# Altium project W2-M_BOARD.PrjPcb
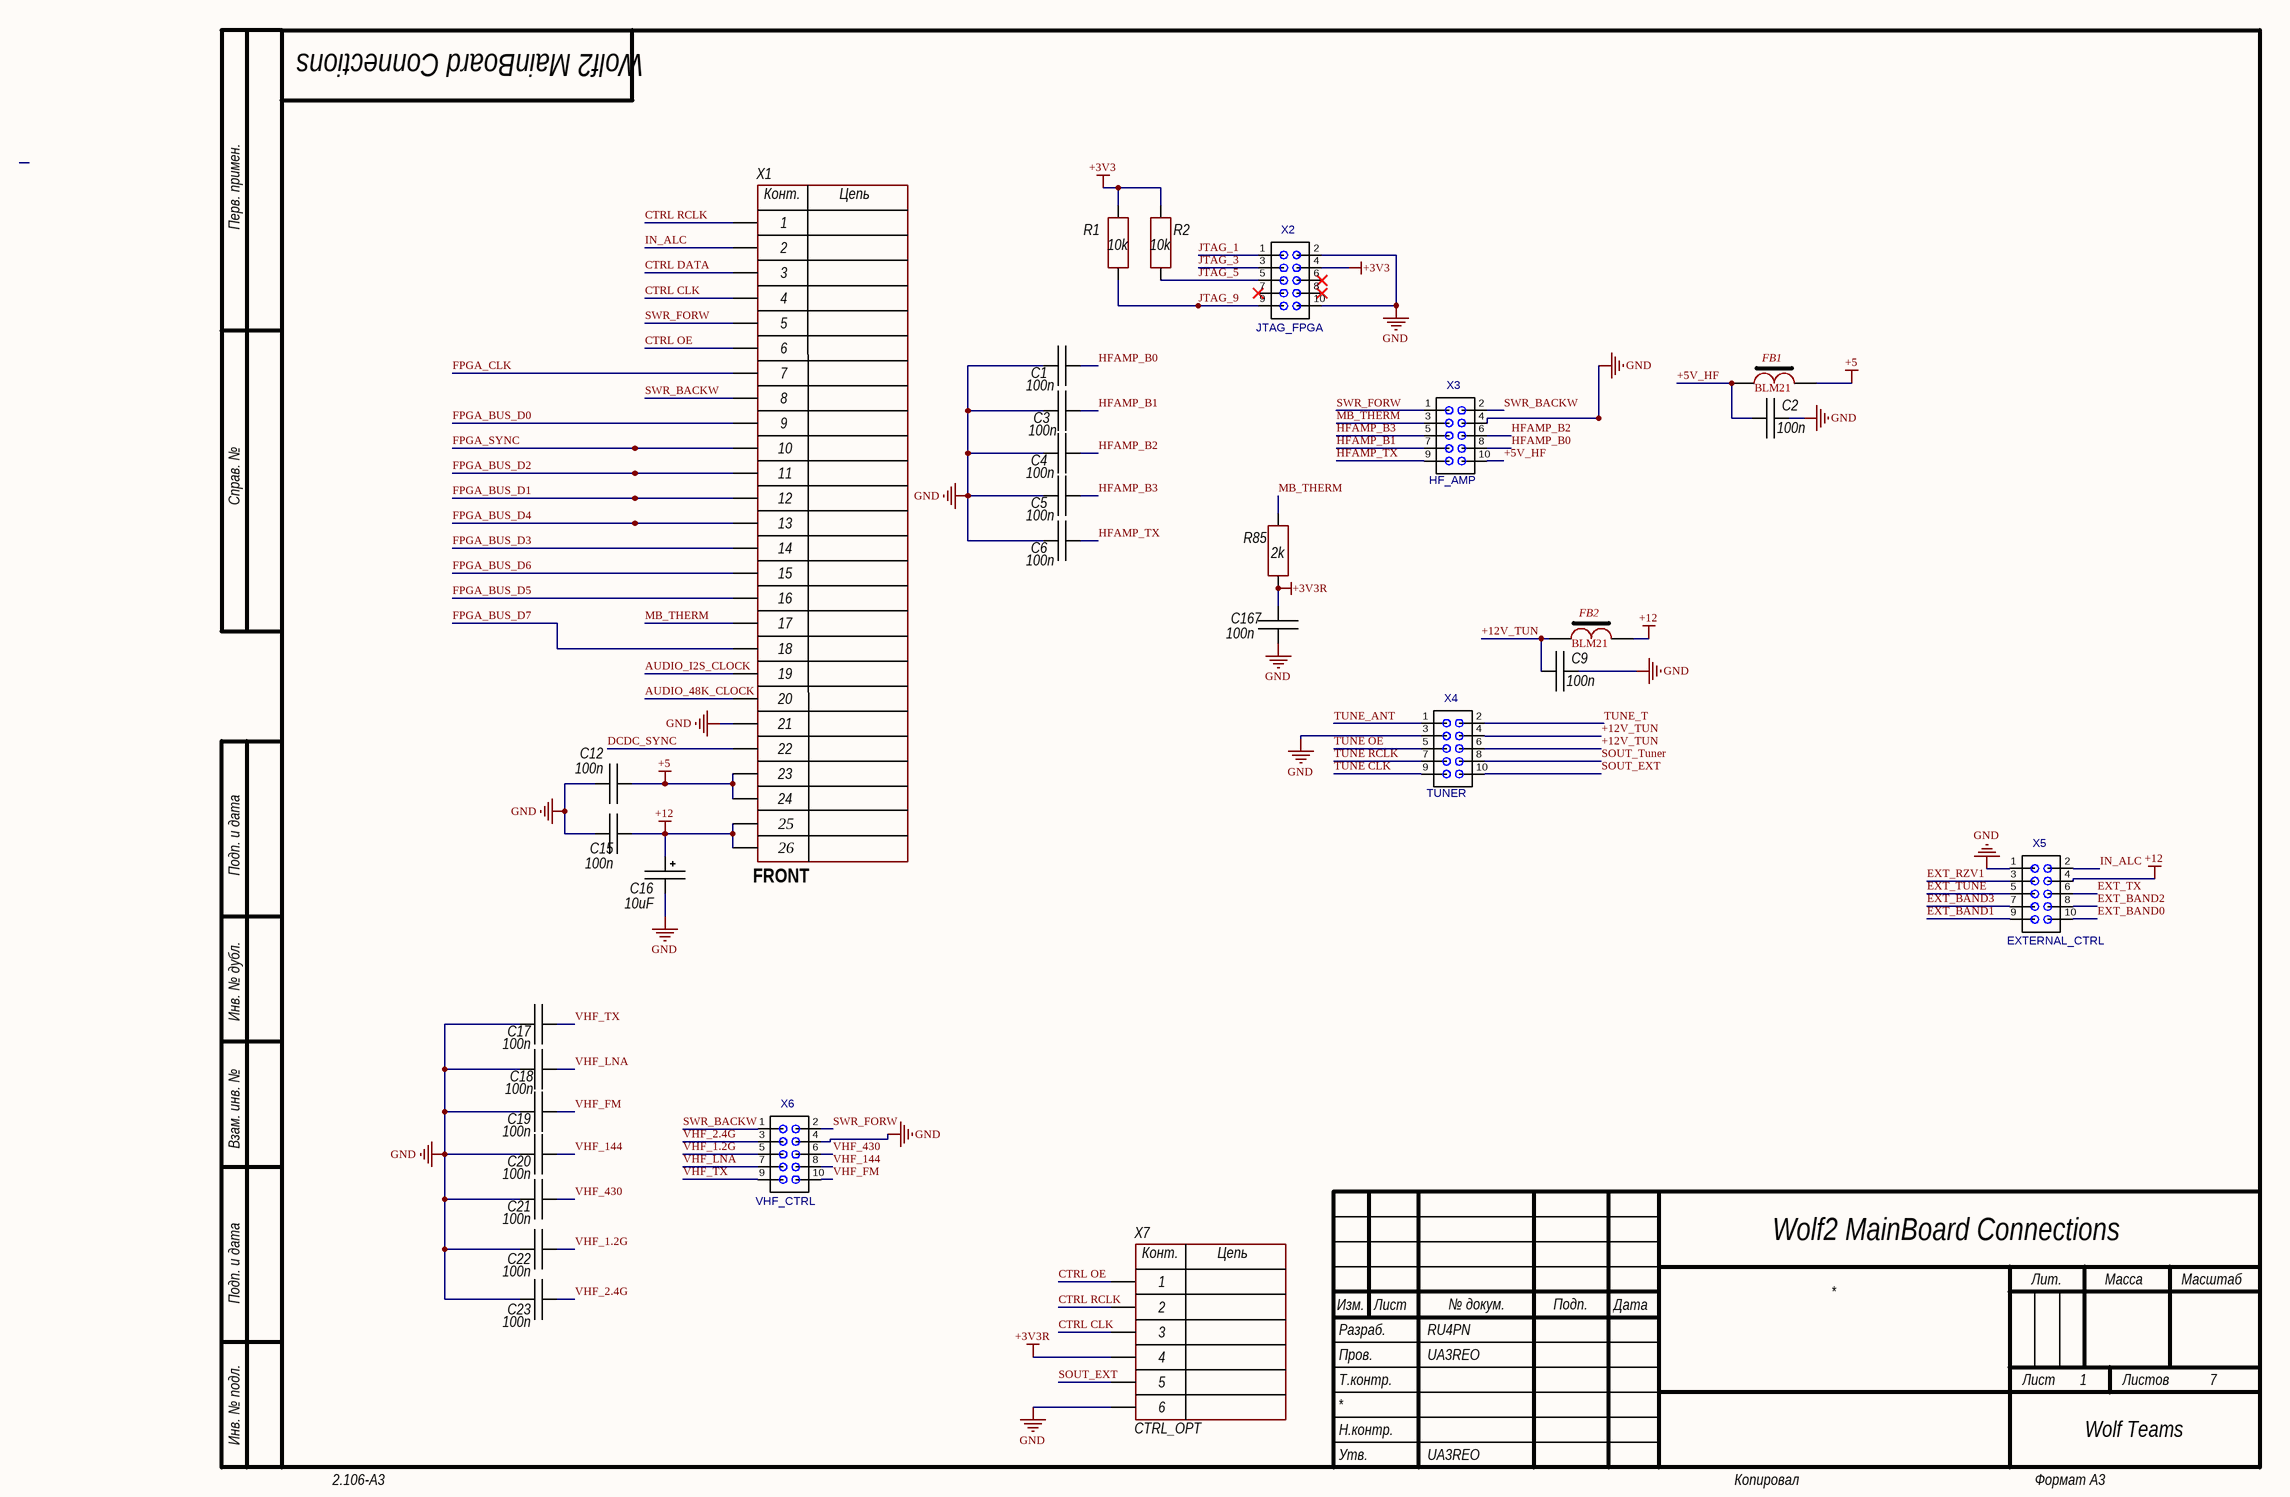
[diagram p0: MB_Conn.SchDoc]
7 sheets, 363 parts. Net scope: global (net labels, ports and power ports of the same name join across sheets).
Board file: MB_PCB.PcbDoc
Sheets:
  MB_Conn.SchDoc
  MB_FPGA.SchDoc
  MB_Power.SchDoc
  MB_ADC.SchDoc
  MB_DAC.SchDoc
  MB_RF.SchDoc
  MB_Control.SchDoc

## Sheet MB_Conn.SchDoc
size 420 x 297 mm; Date: 18/12/2022; ApprovedBy: UA3REO; CheckedBy: UA3REO; Author: RU4PN; CompanyName: Wolf Teams; DocumentNumber: Wolf2 MainBoard Connections; Revision: 0.2; SheetNumber: 1; SheetTotal: 7

### Parts
C1  100n  [CH0805C]
C2  100n  [CH0805C]
C3  100n  [CH0805C]
C4  100n  [CH0805C]
C5  100n  [CH0805C]
C6  100n  [CH0805C]
C9  100n  [CH0805C]
C12  100n  [CH0805C]
C15  100n  [CH0805C]
C16  10uF  [TANTAL_B]
C17  100n  [CH0805C]
C18  100n  [CH0805C]
C19  100n  [CH0805C]
C20  100n  [CH0805C]
C21  100n  [CH0805C]
C22  100n  [CH0805C]
C23  100n  [CH0805C]
C167  100n  [CH0805C]
FB1  BLM21  [CH0805L]
FB2  BLM21  [CH0805L]
R1  10k  [CH0805R]
R2  10k  [CH0805R]
R85  2k  [CH0805R]
X1  FRONT  [CON: IDC-26]
X2  JTAG_FPGA  [CON: BH-10]
X3  HF_AMP  [CON: BH-10]
X4  TUNER  [CON: BH-10]
X5  EXTERNAL_CTRL  [CON: BH-10]
X6  VHF_CTRL  [CON: BH-10]
X7  CTRL_OPT  [CON: PBS-6]

### Nets
+3V3: R1.2 R2.2 X2.4
+3V3R: C167.2 R85.1 X7.4
+5: C12.1 FB1.1 X1.23 X1.24
+12: C15.1 C16.1 FB2.1 X1.25 X1.26 X5.4
GND: C1.2 C2.2 C3.2 C4.2 C5.2 C6.2 C9.2 C12.2 C15.2 C16.2 C17.2 C18.2 C19.2 C20.2 C21.2 C22.2 C23.2 C167.1 X1.21 X2.2 X2.10 X3.4 X4.3 X5.1 X6.4 X7.6
+5V_HF: C2.1 FB1.2 X3.10
+12V_TUN: C9.1 FB2.2 X4.4 X4.6
AUDIO_48K_CLOCK: X1.20
AUDIO_I2S_CLOCK: X1.19
CTRL CLK: X1.4 X7.3
CTRL DATA: X1.3
CTRL OE: X1.6 X7.1
CTRL RCLK: X1.1 X7.2
DCDC_SYNC: X1.22
EXT_BAND0: X5.10
EXT_BAND1: X5.9
EXT_BAND2: X5.8
EXT_BAND3: X5.7
EXT_RZV1: X5.3
EXT_TUNE: X5.5
EXT_TX: X5.6
FPGA_BUS_D0: X1.9
FPGA_BUS_D1: X1.12
FPGA_BUS_D2: X1.11
FPGA_BUS_D3: X1.14
FPGA_BUS_D4: X1.13
FPGA_BUS_D5: X1.16
FPGA_BUS_D6: X1.15
FPGA_BUS_D7: X1.18
FPGA_CLK: X1.7
FPGA_SYNC: X1.10
HFAMP_B0: C1.1 X3.8
HFAMP_B1: C3.1 X3.7
HFAMP_B2: C4.1 X3.6
HFAMP_B3: C5.1 X3.5
HFAMP_TX: C6.1 X3.9
IN_ALC: X1.2 X5.2
JTAG_1: X2.1
JTAG_3: X2.3
JTAG_5: R2.1 X2.5
JTAG_9: R1.1 X2.9
MB_THERM: R85.2 X1.17 X3.3
SOUT_EXT: X4.10 X7.5
SOUT_Tuner: X4.8
SWR_BACKW: X1.8 X3.2 X6.1
SWR_FORW: X1.5 X3.1 X6.2
TUNE CLK: X4.9
TUNE OE: X4.5
TUNE RCLK: X4.7
TUNE_ANT: X4.1
TUNE_T: X4.2
VHF_1.2G: C22.1 X6.5
VHF_2.4G: C23.1 X6.3
VHF_144: C20.1 X6.8
VHF_430: C21.1 X6.6
VHF_FM: C19.1 X6.10
VHF_LNA: C18.1 X6.7
VHF_TX: C17.1 X6.9

Not connected (* = marked no-connect by the designer): X2 6* 7* 8*

### Notes on the sheet
- Перв. примен.
- Справ. №
- Подп. и дата
- Инв. № дубл.
- Взам. инв. №
- Разраб.
- Изм.
- Лист
- № докум.
- Подп.
- Дата
- Лит.
- Масса
- Масштаб
- Пров.
- Т.контр.
- Листов
- Инв. № подл.
- Утв.
- Н.контр.
- 2.106-A3
- Копировал
- Формат А3
- (in symbol 6-Connector) Конт.; Цепь
- (in symbol 26-Connector) Конт.; Цепь

### Library data of the parts
C1-C6 C9 C12 C15 C17-C23 C167 = Capacitor: Manufacturer: *; Model: *; HelpURL: *; ComponentKind: *; Value: *
C16 = TantalCap: Manufacturer: *; Model: *; HelpURL: *; ComponentKind: *; Value: *
FB1 FB2 = FB-1
R1 R2 R85 = Resistor: Manufacturer: *; Model: *; HelpURL: *; ComponentKind: *; Value: *
X1 = 26-Connector: Model: *; Manufacturer: *; HelpURL: *; ComponentKind: *
X2-X6 = IDC10: 2*5 Pin
X7 = 6-Connector: Model: *; Manufacturer: *; HelpURL: *; ComponentKind: *

## Sheet MB_FPGA.SchDoc
size 420 x 297 mm; Date: 18/12/2022; ApprovedBy: UA3REO; CheckedBy: UA3REO; Author: RU4PN; CompanyName: Wolf Teams; DocumentNumber: Wolf2 MainBoard FPGA; SheetNumber: 2; SheetTotal: 7
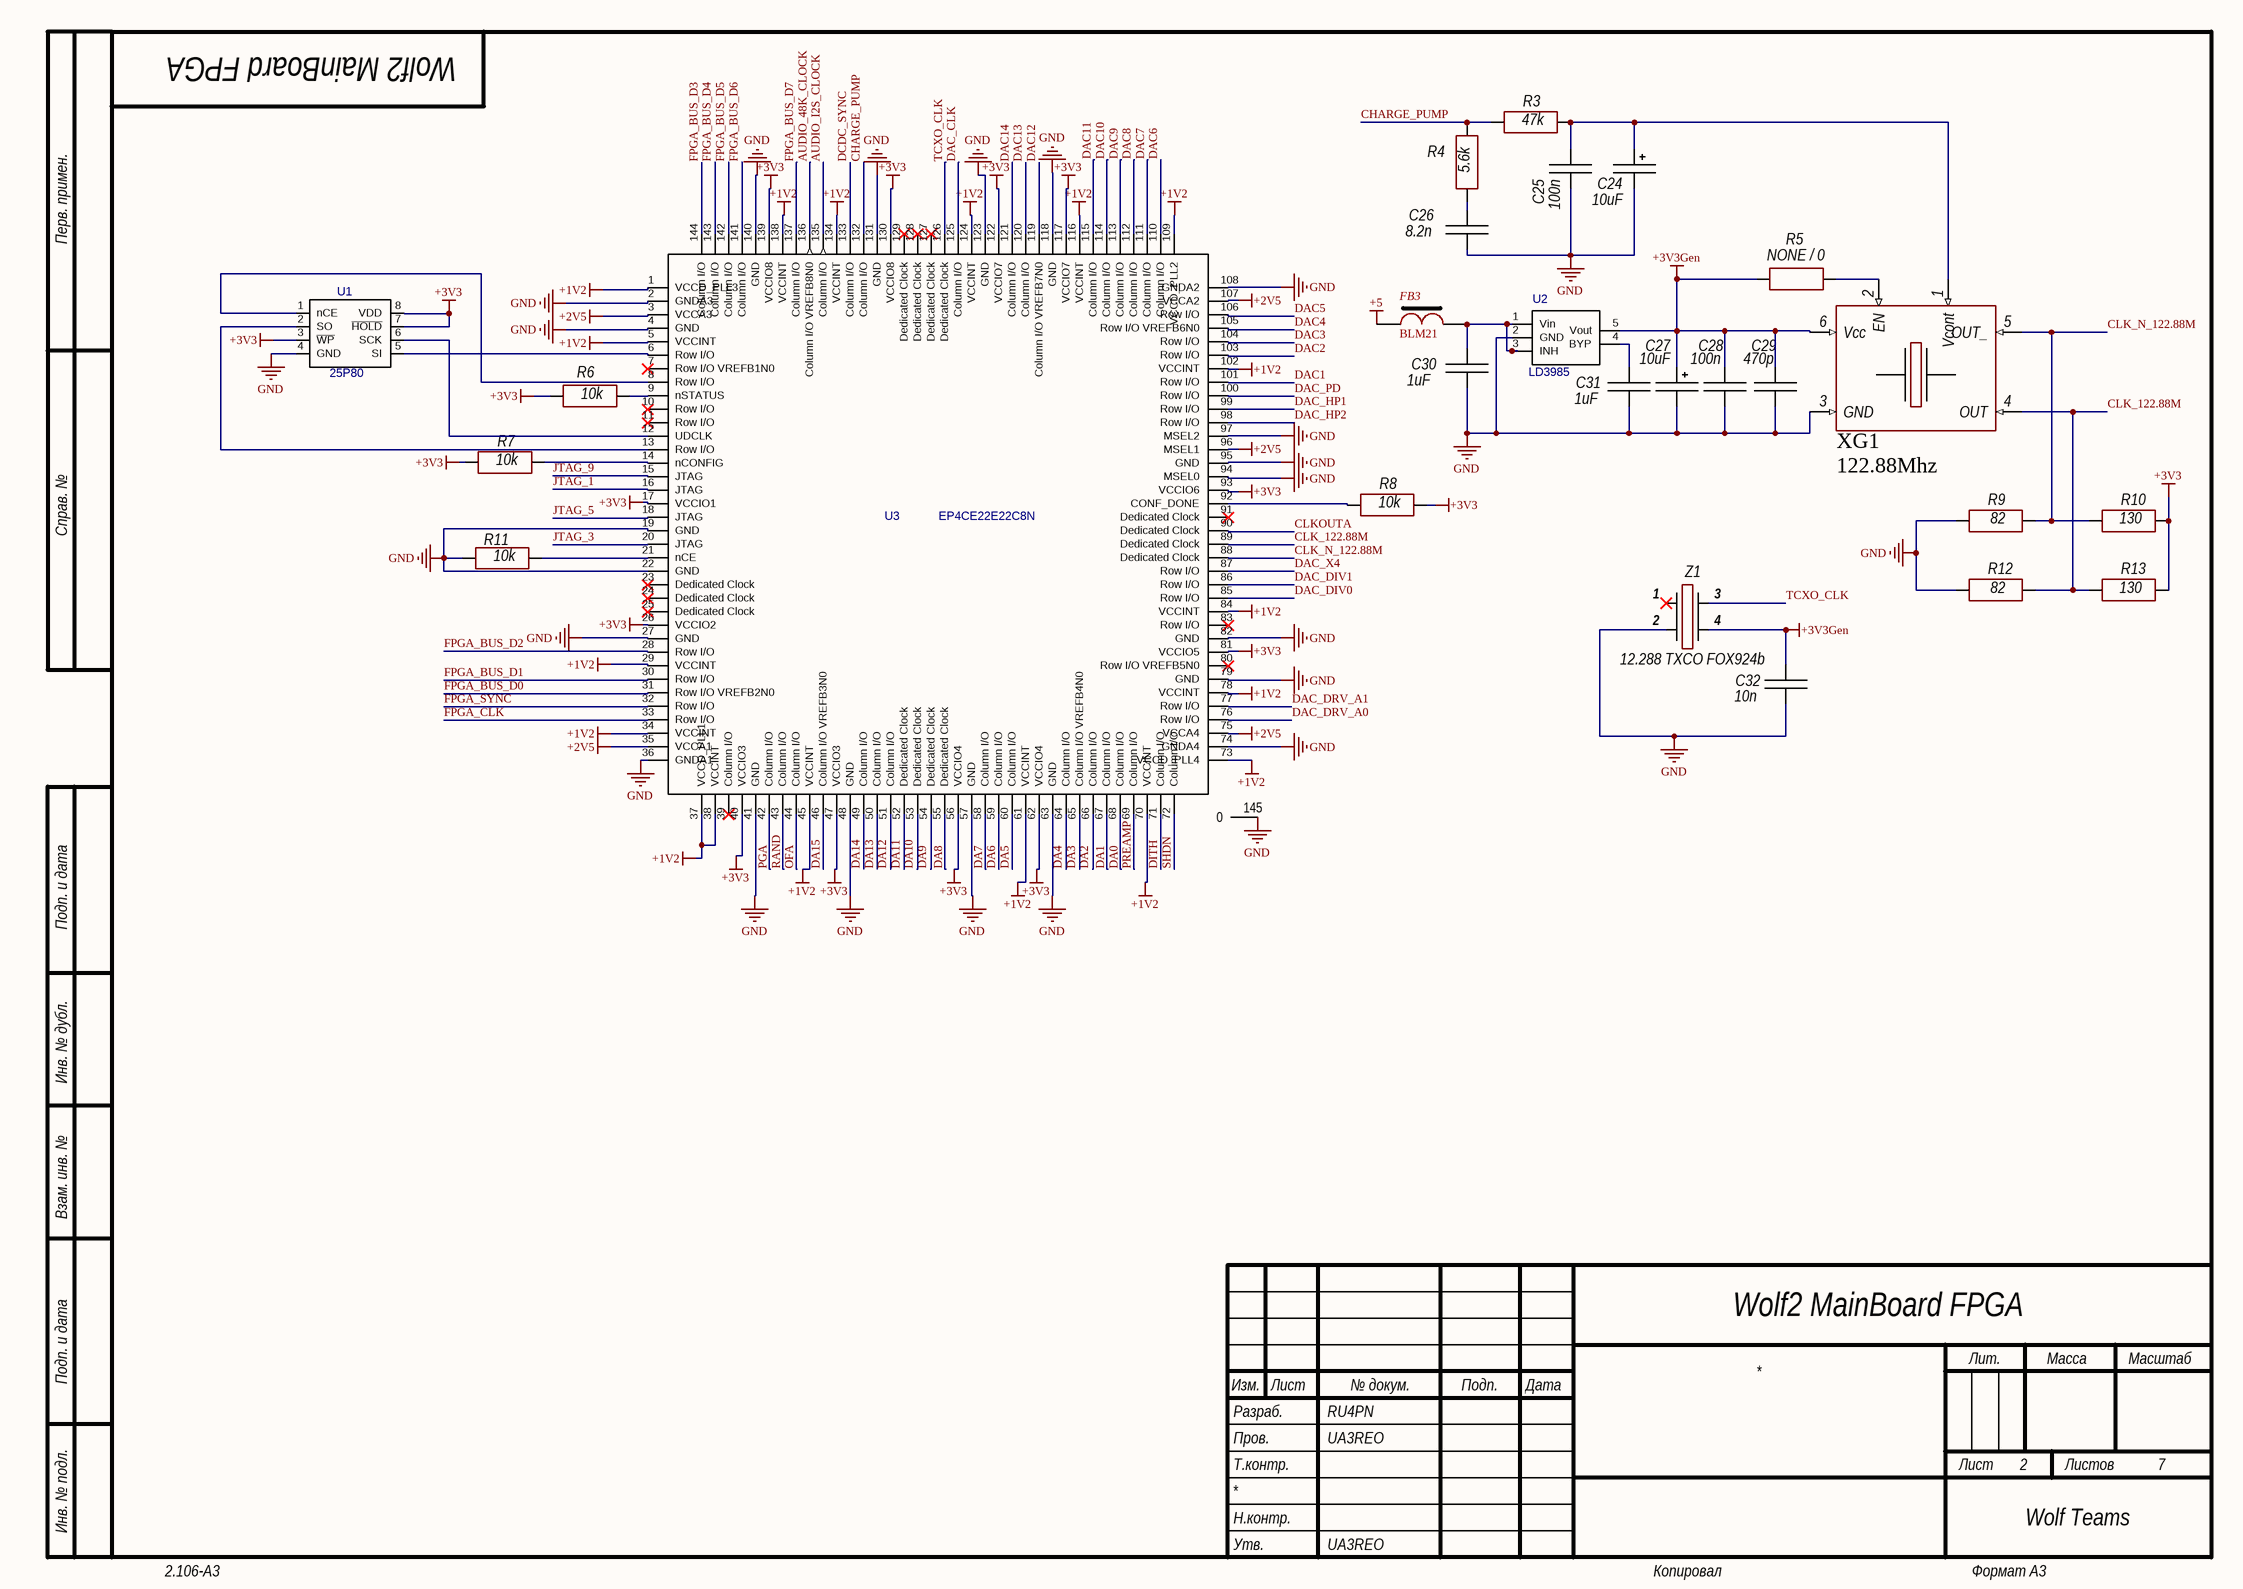
[diagram p1: MB_FPGA.SchDoc]

### Parts
C24  10uF  [TANTAL_B]
C25  100n  [CH0805C]
C26  8.2n  [CH0805C]
C27  10uF  [TANTAL_B]
C28  100n  [CH0805C]
C29  470p  [CH0805C]
C30  1uF  [CH0805C]
C31  1uF  [CH0805C]
C32  10n  [CH0805C]
FB3  BLM21  [CH0805L]
R3  47k  [CH0805R]
R4  5.6k  [CH0805R]
R5  NONE / 0  [CH0805R]
R6  10k  [CH0805R]
R7  10k  [CH0805R]
R8  10k  [CH0805R]
R9  82  [CH0805R]
R10  130  [CH0805R]
R11  10k  [CH0805R]
R12  82  [CH0805R]
R13  130  [CH0805R]
U1  25P80  [25P80]
U2  LD3985  [LD3985]
U3  EP4CE22E22C8N  [QFP144-20-2222A]
XG1  122.88Mhz  [OCS: GENA]
Z1  12.288 TXCO FOX924b  [TCXO]

### Nets
+1V2: U3.1(VCCD_PLL3) U3.5(VCCINT) U3.29(VCCINT) U3.34(VCCINT) U3.37(VCCD_PLL1) U3.38(VCCINT) U3.45(VCCINT) U3.61(VCCINT) U3.70(VCCINT) U3.73(VCCD_PLL4) U3.78(VCCINT) U3.84(VCCINT) U3.102(VCCINT) U3.109(VCCD_PLL2) U3.116(VCCINT) U3.124(VCCINT) U3.134(VCCINT) U3.138(VCCINT)
+2V5: U3.3(VCCA3) U3.35(VCCA1) U3.75(VCCA4) U3.96(MSEL1) U3.107(VCCA2)
+3V3: R6.2 R7.2 R8.1 R10.1 R13.1 U1.3(~{WP}) U1.7(~{HOLD}) U1.8(VDD) U3.17(VCCIO1) U3.26(VCCIO2) U3.40(VCCIO3) U3.47(VCCIO3) U3.56(VCCIO4) U3.62(VCCIO4) U3.81(VCCIO5) U3.93(VCCIO6) U3.117(VCCIO7) U3.122(VCCIO7) U3.130(VCCIO8) U3.139(VCCIO8)
+3V3Gen: C27.1 C28.1 C29.1 C32.1 R5.2 U2.5(Vout) XG1.6(Vcc) Z1.4
+5: FB3.2
GND: C24.2 C25.2 C26.2 C27.2 C28.2 C29.2 C30.2 C31.2 C32.2 R9.2 R11.2 R12.2 U1.4(GND) U2.2(GND) U3.2(GNDA3) U3.4(GND) U3.19(GND) U3.22(GND) U3.27(GND) U3.36(GNDA1) U3.41(GND) U3.48(GND) U3.57(GND) U3.63(GND) U3.74(GNDA4) U3.79(GND) U3.82(GND) U3.94(MSEL0) U3.95(GND) U3.97(MSEL2) U3.108(GNDA2) U3.118(GND) U3.123(GND) U3.131(GND) U3.140(GND) U3.145(0) XG1.3(GND) Z1.2
AUDIO_48K_CLOCK: U3.136(Column_I/O_VREFB8N0)
AUDIO_I2S_CLOCK: U3.135(Column_I/O)
CHARGE_PUMP: R3.2 R4.1 U3.132(Column_I/O)
CLK_122.88M: R12.1 R13.2 U3.89(Dedicated_Clock) XG1.4(OUT)
CLK_N_122.88M: R9.1 R10.2 U3.88(Dedicated_Clock) XG1.5(OUT_)
CLKOUTA: U3.90(Dedicated_Clock)
DA0: U3.68(Column_I/O)
DA1: U3.67(Column_I/O)
DA2: U3.66(Column_I/O)
DA3: U3.65(Column_I/O_VREFB4N0)
DA4: U3.64(Column_I/O)
DA5: U3.60(Column_I/O)
DA6: U3.59(Column_I/O)
DA7: U3.58(Column_I/O)
DA8: U3.55(Dedicated_Clock)
DA9: U3.54(Dedicated_Clock)
DA10: U3.53(Dedicated_Clock)
DA11: U3.52(Dedicated_Clock)
DA12: U3.51(Column_I/O)
DA13: U3.50(Column_I/O)
DA14: U3.49(Column_I/O)
DA15: U3.46(Column_I/O_VREFB3N0)
DAC1: U3.101(Row_I/O)
DAC2: U3.103(Row_I/O)
DAC3: U3.104(Row_I/O)
DAC4: U3.105(Row_I/O_VREFB6N0)
DAC5: U3.106(Row_I/O)
DAC6: U3.110(Column_I/O)
DAC7: U3.111(Column_I/O)
DAC8: U3.112(Column_I/O)
DAC9: U3.113(Column_I/O)
DAC10: U3.114(Column_I/O)
DAC11: U3.115(Column_I/O)
DAC12: U3.119(Column_I/O_VREFB7N0)
DAC13: U3.120(Column_I/O)
DAC14: U3.121(Column_I/O)
DAC_CLK: U3.125(Column_I/O)
DAC_DIV0: U3.85(Row_I/O)
DAC_DIV1: U3.86(Row_I/O)
DAC_DRV_A0: U3.76(Row_I/O)
DAC_DRV_A1: U3.77(Row_I/O)
DAC_HP1: U3.99(Row_I/O)
DAC_HP2: U3.98(Row_I/O)
DAC_PD: U3.100(Row_I/O)
DAC_X4: U3.87(Row_I/O)
DCDC_SYNC: U3.133(Column_I/O)
DITH: U3.71(Column_I/O)
FPGA_BUS_D0: U3.31(Row_I/O_VREFB2N0)
FPGA_BUS_D1: U3.30(Row_I/O)
FPGA_BUS_D2: U3.28(Row_I/O)
FPGA_BUS_D3: U3.144(Column_I/O)
FPGA_BUS_D4: U3.143(Column_I/O)
FPGA_BUS_D5: U3.142(Column_I/O)
FPGA_BUS_D6: U3.141(Column_I/O)
FPGA_BUS_D7: U3.137(Column_I/O)
FPGA_CLK: U3.33(Row_I/O)
FPGA_SYNC: U3.32(Row_I/O)
JTAG_1: U3.16(JTAG)
JTAG_3: U3.20(JTAG)
JTAG_5: U3.18(JTAG)
JTAG_9: U3.15(JTAG)
OFA: U3.44(Column_I/O)
PGA: U3.42(Column_I/O)
PREAMP: U3.69(Column_I/O)
RAND: U3.43(Column_I/O)
SHDN: U3.72(Column_I/O)
TCXO_CLK: U3.126(Dedicated_Clock) Z1.3
NetC24_1: C24.1 C25.1 R3.1 XG1.1(Vcont)
NetC26_1: C26.1 R4.2
NetC30_1: C30.1 FB3.1 U2.1(Vin) U2.3(INH)
NetC31_1: C31.1 U2.4(BYP)
NetR5_1: R5.1 XG1.2(EN)
NetR6_1: R6.1 U3.9(nSTATUS)
NetR7_1: R7.1 U3.14(nCONFIG)
NetR8_2: R8.2 U3.92(CONF_DONE)
NetR11_1: R11.1 U3.21(nCE)
NetU1_1: U1.1(nCE) U3.8(Row_I/O)
NetU1_2: U1.2(SO) U3.13(Row_I/O)
NetU1_5: U1.5(SI) U3.6(Row_I/O)
NetU1_6: U1.6(SCK) U3.12(UDCLK)

Not connected (* = marked no-connect by the designer): U3 7(Row_I/O_VREFB1N0)* 10(Row_I/O)* 11(Row_I/O)* 23(Dedicated_Clock)* 24(Dedicated_Clock)* 25(Dedicated_Clock)* 39(Column_I/O)* 80(Row_I/O_VREFB5N0)* 83(Row_I/O)* 91(Dedicated_Clock)* 127(Dedicated_Clock)* 128(Dedicated_Clock)* 129(Dedicated_Clock)*; Z1 1*

### Notes on the sheet
- Перв. примен.
- Справ. №
- Подп. и дата
- Инв. № дубл.
- Взам. инв. №
- Разраб.
- Изм.
- Лист
- № докум.
- Подп.
- Дата
- Лит.
- Масса
- Масштаб
- Пров.
- Т.контр.
- Листов
- Инв. № подл.
- Утв.
- Н.контр.
- 2.106-A3
- Копировал
- Формат А3

### Library data of the parts
C24 C27 = TantalCap: Manufacturer: *; Model: *; HelpURL: *; ComponentKind: *; Value: *
C25 C26 C28-C32 = Capacitor: Manufacturer: *; Model: *; HelpURL: *; ComponentKind: *; Value: *
FB3 = FB-1
R3-R13 = Resistor: Manufacturer: *; Model: *; HelpURL: *; ComponentKind: *; Value: *
XG1 = NV7050SA: Generator
Z1 = Generator: Manufacturer: *; Model: *; HelpURL: *; ComponentKind: *; Value: *
U1 = 25P80: Value: 25P80
U2 = LD3985: Value: LD3985
U3 = EP4CE22E22C8N: Value: EP4CE22E22C8N

## Sheet MB_Power.SchDoc
size 420 x 297 mm; Date: 18/12/2022; ApprovedBy: UA3REO; CheckedBy: UA3REO; Author: RU4PN; CompanyName: Wolf Team; DocumentNumber: Wolf2 MainBoard Power; SheetNumber: 3; SheetTotal: 7
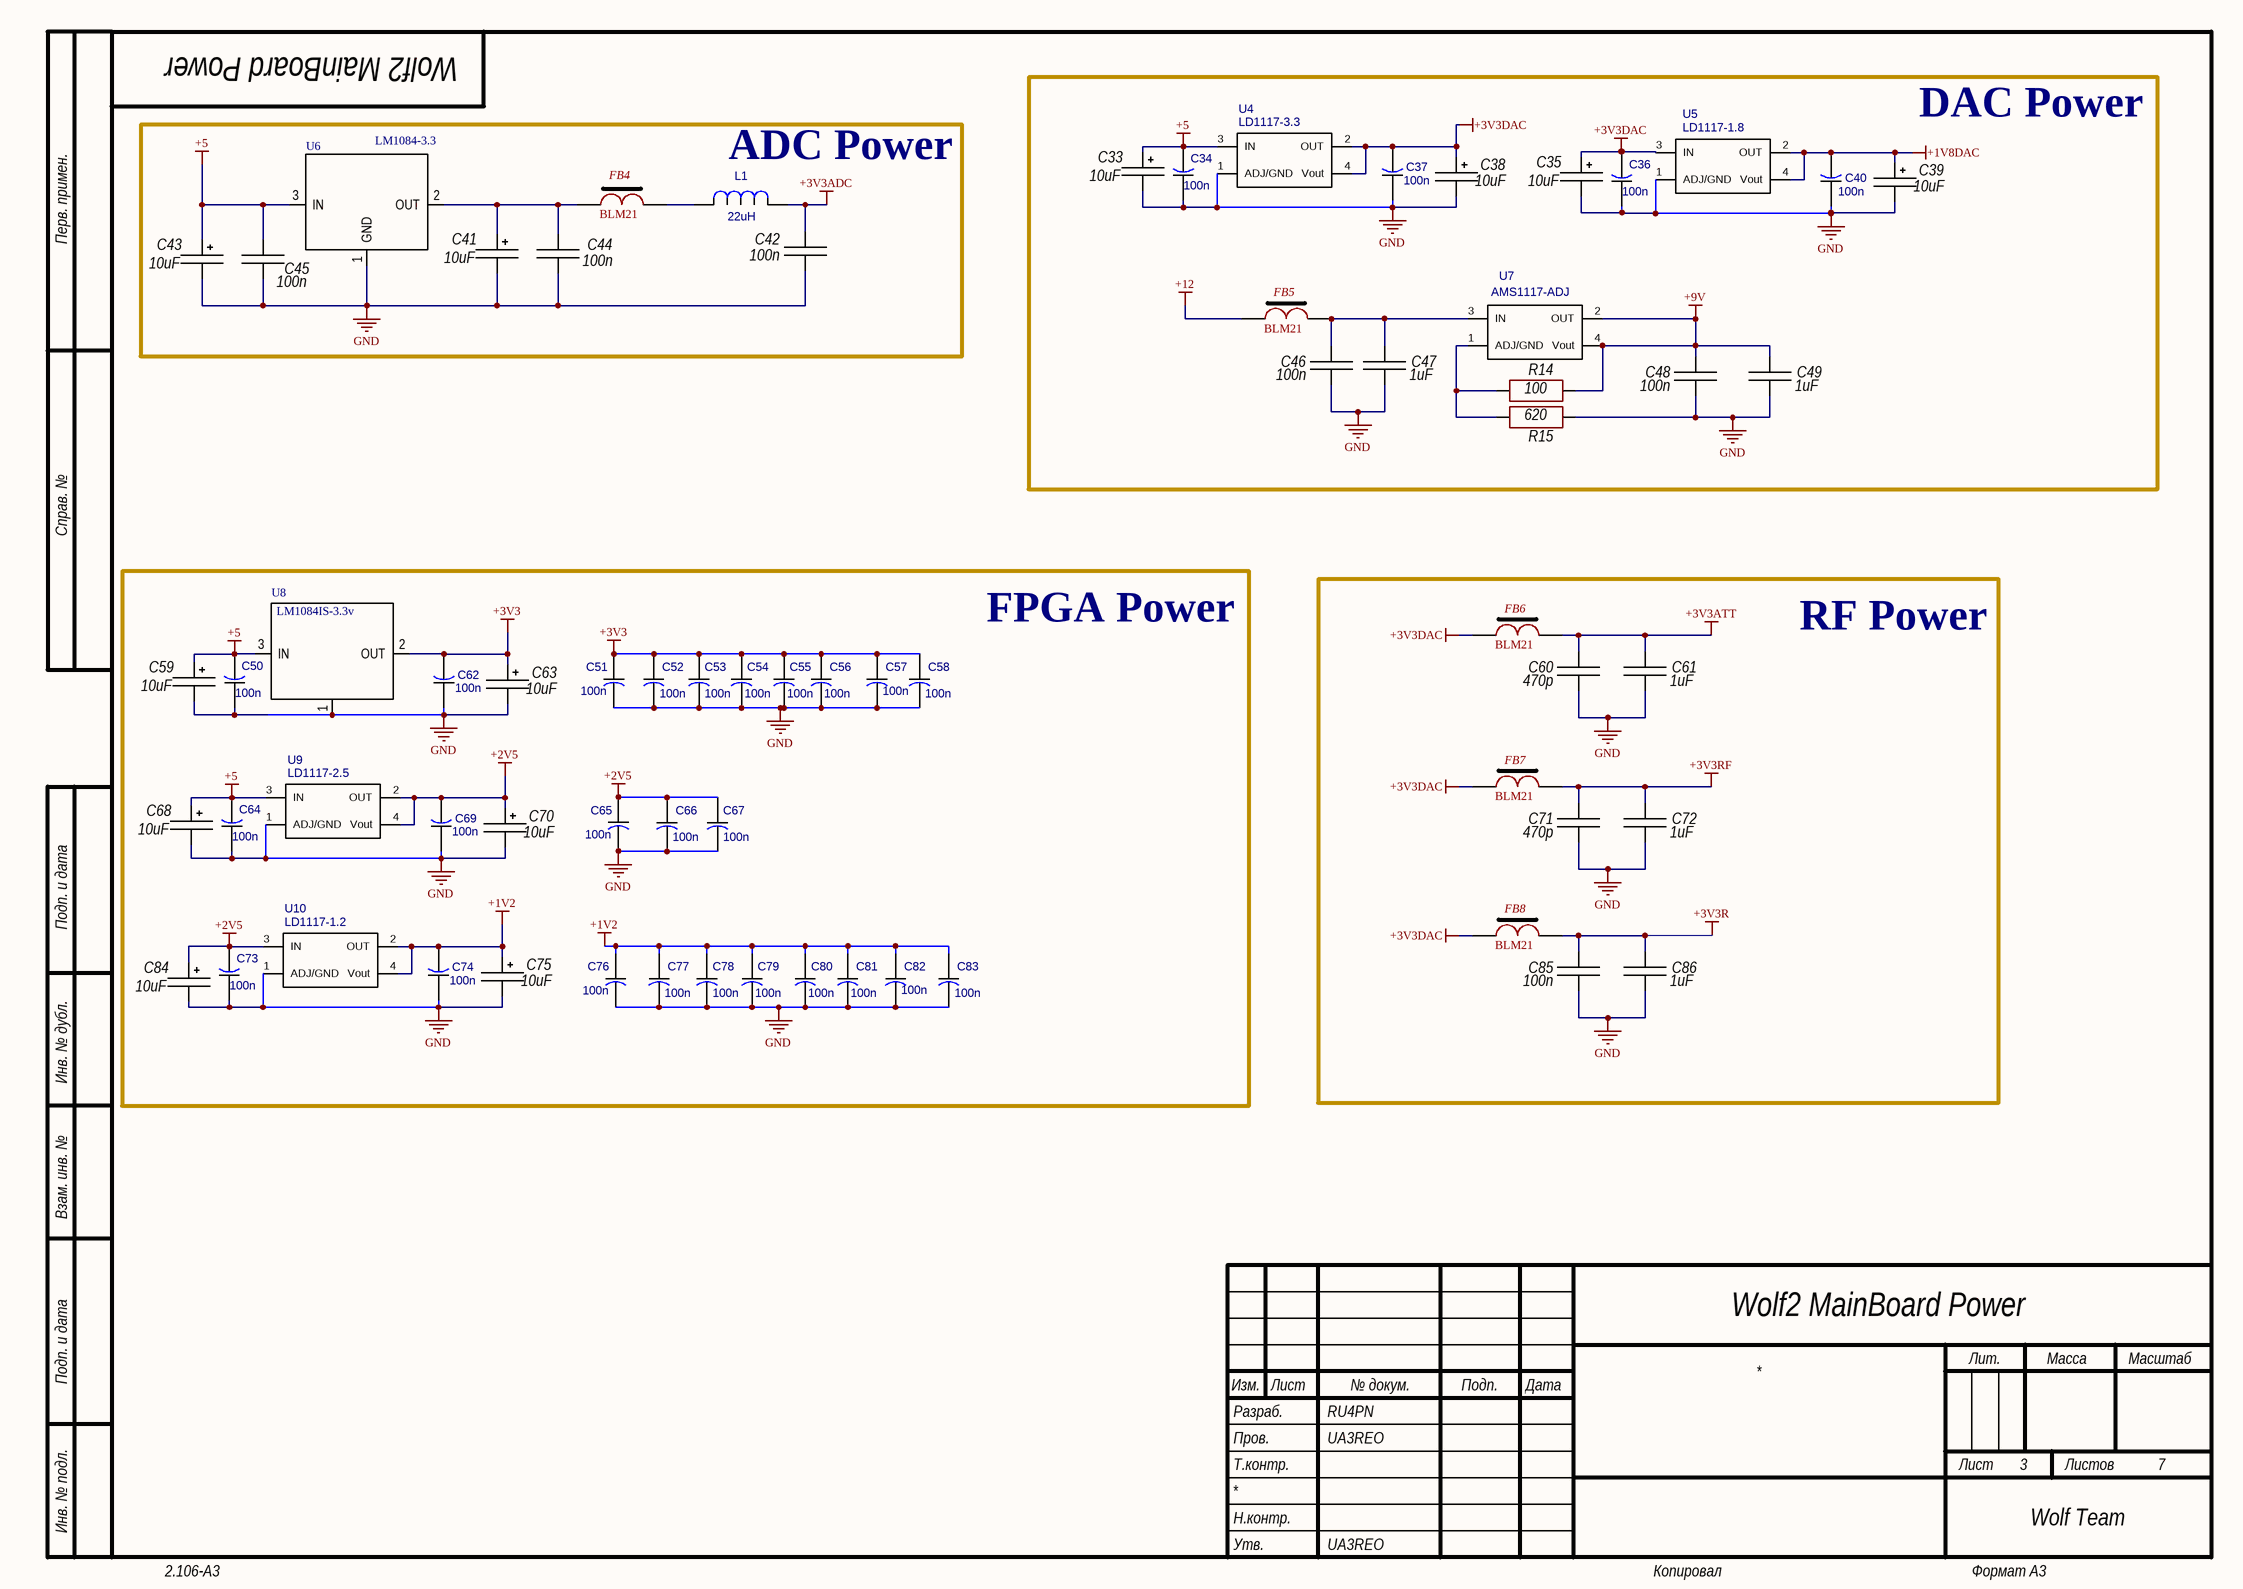
[diagram p2: MB_Power.SchDoc]

### Parts
C33  10uF  [TANTAL_B]
C34  100n  [CAP_0805]
C35  10uF  [TANTAL_B]
C36  100n  [CAP_0805]
C37  100n  [CAP_0805]
C38  10uF  [TANTAL_B]
C39  10uF  [TANTAL_B]
C40  100n  [CAP_0805]
C41  10uF  [TANTAL_B]
C42  100n  [CH0805C]
C43  10uF  [TANTAL_B]
C44  100n  [CH0805C]
C45  100n  [CH0805C]
C46  100n  [CH0805C]
C47  1uF  [CH0805C]
C48  100n  [CH0805C]
C49  1uF  [CH0805C]
C50  100n  [CAP_0805]
C51  100n  [CH0805C]
C52  100n  [CH0805C]
C53  100n  [CH0805C]
C54  100n  [CH0805C]
C55  100n  [CH0805C]
C56  100n  [CH0805C]
C57  100n  [CH0805C]
C58  100n  [CH0805C]
C59  10uF  [TANTAL_B]
C60  470p  [CH0805C]
C61  1uF  [CH0805C]
C62  100n  [CAP_0805]
C63  10uF  [TANTAL_B]
C64  100n  [CAP_0805]
C65  100n  [CH0805C]
C66  100n  [CH0805C]
C67  100n  [CH0805C]
C68  10uF  [TANTAL_B]
C69  100n  [CAP_0805]
C70  10uF  [TANTAL_B]
C71  470p  [CH0805C]
C72  1uF  [CH0805C]
C73  100n  [CAP_0805]
C74  100n  [CAP_0805]
C75  10uF  [TANTAL_B]
C76  100n  [CH0805C]
C77  100n  [CH0805C]
C78  100n  [CH0805C]
C79  100n  [CH0805C]
C80  100n  [CH0805C]
C81  100n  [CH0805C]
C82  100n  [CH0805C]
C83  100n  [CH0805C]
C84  10uF  [TANTAL_B]
C85  100n  [CH0805C]
C86  1uF  [CH0805C]
FB4  BLM21  [CH0805L]
FB5  BLM21  [CH0805L]
FB6  BLM21  [CH0805L]
FB7  BLM21  [CH0805L]
FB8  BLM21  [CH0805L]
L1  22uH  [IND_7x7]
R14  100  [CH0805R]
R15  620  [CH0805R]
U4  value LD1117-3.3  [LT1117CST-3.3_2]  (hidden comment: 1117-3.3)
U5  value LD1117-1.8  [LT1117CST-3.3]  (hidden comment: 1117-1.8)
U6  LM1084-3.3  [LM1084-3.3]
U7  value AMS1117-ADJ  [LT1117CST-3.3]  (hidden comment: 1117-ADJ)
U8  LM1084IS-3.3v  [LM1084-3.3]
U9  value LD1117-2.5  [LT1117CST-3.3_2]  (hidden comment: 1117-2.5)
U10  value LD1117-1.2  [LT1117CST-3.3_2]  (hidden comment: 1117-1.2)

### Blocks framed on the sheet
DAC Power: C33-C40 C46-C49 FB5 R14 R15 U4 U5 U7
ADC Power: C41-C45 FB4 L1 U6
FPGA Power: C50-C59 C62-C70 C73-C84 U8-U10
RF Power: C60 C61 C71 C72 C85 C86 FB6-FB8

### Nets
+1V2: C74.2 C75.1 C76.1 C77.1 C78.1 C79.1 C80.1 C81.1 C82.1 C83.1 U10.2(OUT) U10.4(Vout)
+1V8DAC: C39.1 C40.2 U5.2(OUT) U5.4(Vout)
+2V5: C65.1 C66.1 C67.1 C69.2 C70.1 C73.2 C84.1 U9.2(OUT) U9.4(Vout) U10.3(IN)
+3V3: C51.1 C52.1 C53.1 C54.1 C55.1 C56.1 C57.1 C58.1 C62.2 C63.1 U8.2(OUT)
+3V3ADC: C42.1 L1.2
+3V3ATT: C60.1 C61.1 FB6.1
+3V3DAC: C35.1 C36.2 C37.2 C38.1 FB6.2 FB7.2 FB8.2 U4.2(OUT) U4.4(Vout) U5.3(IN)
+3V3R: C85.1 C86.1 FB8.1
+3V3RF: C71.1 C72.1 FB7.1
+5: C33.1 C34.2 C43.1 C45.1 C50.2 C59.1 C64.2 C68.1 U4.3(IN) U6.3(IN) U8.3(IN) U9.3(IN)
+9V: C48.1 C49.1 R14.1 U7.2(OUT) U7.4(Vout)
+12: FB5.2
GND: C33.2 C34.1 C35.2 C36.1 C37.1 C38.2 C39.2 C40.1 C41.2 C42.2 C43.2 C44.2 C45.2 C46.2 C47.2 C48.2 C49.2 C50.1 C51.2 C52.2 C53.2 C54.2 C55.2 C56.2 C57.2 C58.2 C59.2 C60.2 C61.2 C62.1 C63.2 C64.1 C65.2 C66.2 C67.2 C68.2 C69.1 C70.2 C71.2 C72.2 C73.1 C74.1 C75.2 C76.2 C77.2 C78.2 C79.2 C80.2 C81.2 C82.2 C83.2 C84.2 C85.2 C86.2 R15.1 U4.1(ADJ/GND) U5.1(ADJ/GND) U6.1(GND) U8.1 U9.1(ADJ/GND) U10.1(ADJ/GND)
NetC41_1: C41.1 C44.1 FB4.2 U6.2(OUT)
NetC46_1: C46.1 C47.1 FB5.1 U7.3(IN)
NetFB4_1: FB4.1 L1.1
NetR14_2: R14.2 R15.2 U7.1(ADJ/GND)

### Notes on the sheet
- Перв. примен.
- Справ. №
- Подп. и дата
- Инв. № дубл.
- Взам. инв. №
- Разраб.
- Изм.
- Лист
- № докум.
- Подп.
- Дата
- Лит.
- Масса
- Масштаб
- Пров.
- Т.контр.
- Листов
- Инв. № подл.
- Утв.
- Н.контр.
- 2.106-A3
- Копировал
- Формат А3

### Library data of the parts
C33 C35 C38 C39 C41 C43 C59 C63 C68 C70 C75 C84 = TantalCap: Manufacturer: *; Model: *; HelpURL: *; ComponentKind: *; Value: *
C34 C36 C37 C40 C50-C58 C62 C64-C67 C69 C73 C74 C76-C83 = CAP_0805: Value: 100n
C42 C44-C49 C60 C61 C71 C72 C85 C86 = Capacitor: Manufacturer: *; Model: *; HelpURL: *; ComponentKind: *; Value: *
FB4-FB8 = FB-1
L1 = IND_1206
R14 R15 = Resistor: Manufacturer: *; Model: *; HelpURL: *; ComponentKind: *; Value: *
U4 = LT1117CST-3.3
U5 = LT1117CST-3.3: LT1117CST-1.8
U6 U8 = LM1084
U7 = LT1117CST-3.3: LT1117CST-ADJ
U9 = LT1117CST-3.3: LT1117CST-2.5
U10 = LT1117CST-3.3: LT1117CST-1.2

## Sheet MB_ADC.SchDoc
size 420 x 297 mm; Date: 18/12/2022; ApprovedBy: UA3REO; CheckedBy: UA3REO; Author: RU4PN; CompanyName: Wolf Team; DocumentNumber: Wolf2 MainBoard ADC; SheetNumber: 4; SheetTotal: 7
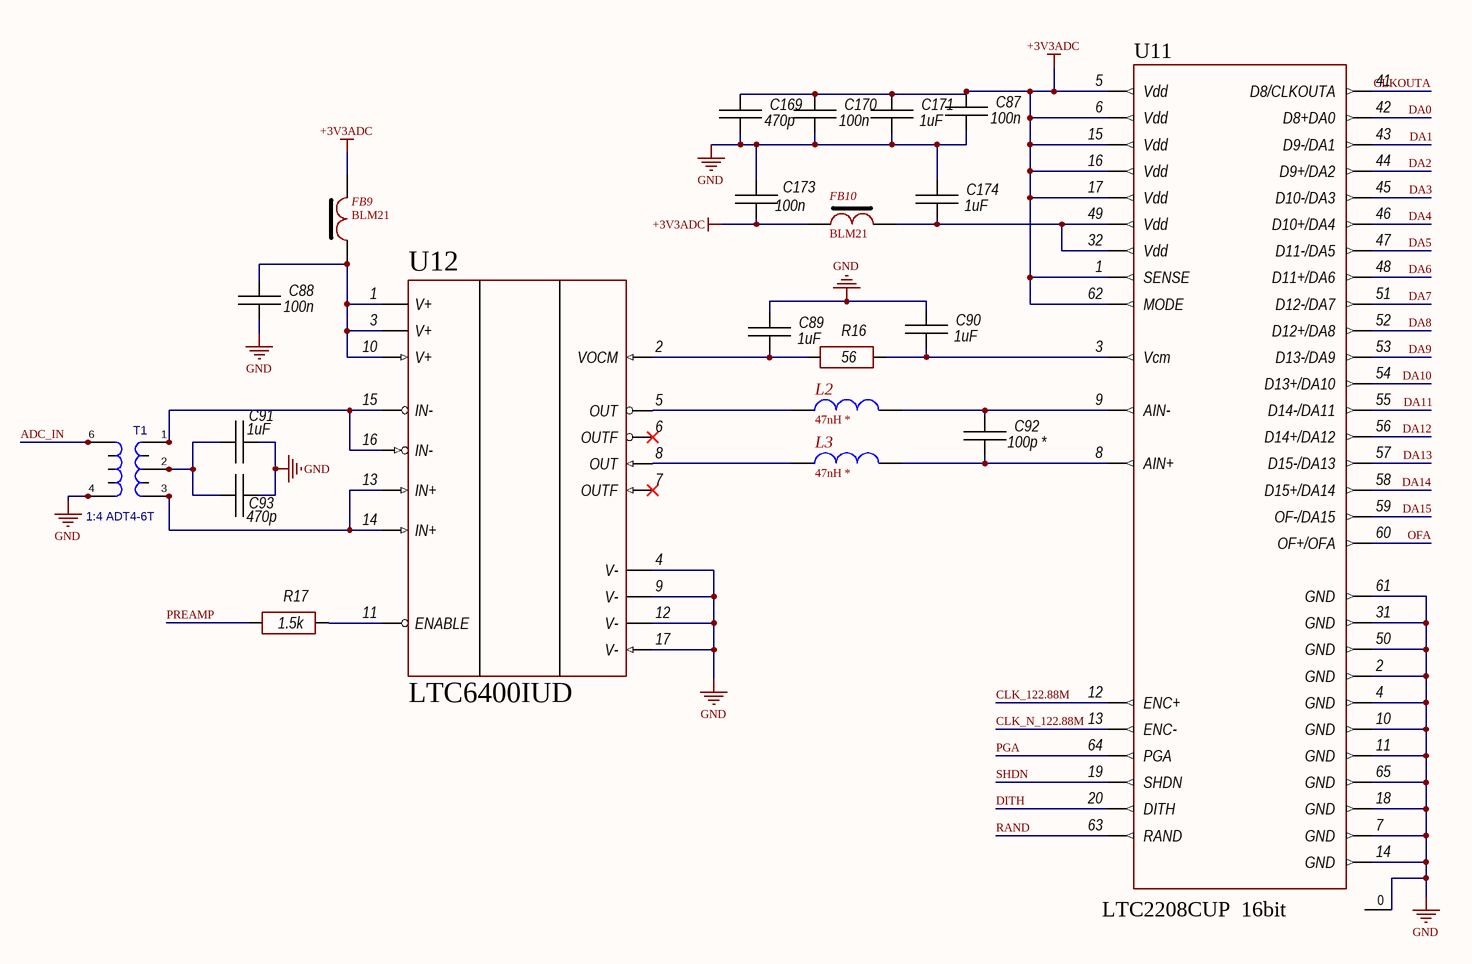
[diagram p3: MB_ADC.SchDoc]

### Parts
C87  100n  [CH0805C]
C88  100n  [CH0805C]
C89  1uF  [CH0805C]
C90  1uF  [CH0805C]
C91  1uF  [CH0805C]
C92  100p *  [CH0805C]
C93  470p  [CH0805C]
C169  470p  [CH0805C]
C170  100n  [CH0805C]
C171  1uF  [CH0805C]
C173  100n  [CH0805C]
C174  1uF  [CH0805C]
FB9  BLM21  [CH0805L]
FB10  BLM21  [CH0805F]
L2  47nH *  [CH1210L]
L3  47nH *  [CH1210L]
R16  56  [CH0805R]
R17  1.5k  [CH0805R]
T1  1:4 ADT4-6T  [TRANSF_ACORE2]
U11  LTC2208CUP  16bit  [64-QFN (9x9)]
U12  LTC6400IUD  [16-QFN 3x3]

### Nets
+3V3ADC: C87.1 C169.1 C170.1 C171.1 C173.2 FB9.1 FB10.2 U11.1(SENSE) U11.5(Vdd) U11.6(Vdd) U11.15(Vdd) U11.16(Vdd) U11.17(Vdd) U11.62(MODE)
GND: C87.2 C88.2 C89.1 C90.1 C91.2 C93.2 C169.2 C170.2 C171.2 C173.1 C174.1 T1.4(P1) T1.11 U11.0 U11.2(GND) U11.4(GND) U11.7(GND) U11.10(GND) U11.11(GND) U11.14(GND) U11.18(GND) U11.31(GND) U11.50(GND) U11.61(GND) U11.65(GND) U12.4(V-) U12.9(V-) U12.12(V-) U12.17(V-)
ADC_IN: T1.6(P2) T1.10
CLK_122.88M: U11.12(ENC+)
CLK_N_122.88M: U11.13(ENC-)
CLKOUTA: U11.41(D8/CLKOUTA)
DA0: U11.42(D8+DA0)
DA1: U11.43(D9-/DA1)
DA2: U11.44(D9+/DA2)
DA3: U11.45(D10-/DA3)
DA4: U11.46(D10+/DA4)
DA5: U11.47(D11-/DA5)
DA6: U11.48(D11+/DA6)
DA7: U11.51(D12-/DA7)
DA8: U11.52(D12+/DA8)
DA9: U11.53(D13-/DA9)
DA10: U11.54(D13+/DA10)
DA11: U11.55(D14-/DA11)
DA12: U11.56(D14+/DA12)
DA13: U11.57(D15-/DA13)
DA14: U11.58(D15+/DA14)
DA15: U11.59(OF-/DA15)
DITH: U11.20(DITH)
OFA: U11.60(OF+/OFA)
PGA: U11.64(PGA)
PREAMP: R17.2
RAND: U11.63(RAND)
SHDN: U11.19(SHDN)
NetC88_1: C88.1 FB9.2 U12.1(V+) U12.3(V+) U12.10(V+)
NetC89_2: C89.2 R16.2 U12.2(VOCM)
NetC90_2: C90.2 R16.1 U11.3(Vcm)
NetC91_1: C91.1 C93.1 T1.2(S2) T1.8
NetC92_1: C92.1 L2.1 U11.9(AIN-)
NetC92_2: C92.2 L3.1 U11.8(AIN+)
NetC174_2: C174.2 FB10.1 U11.32(Vdd) U11.49(Vdd)
NetL2_2: L2.2 U12.5(OUT)
NetL3_2: L3.2 U12.8(OUT)
NetR17_1: R17.1 U12.11(ENABLE)
NetT1_1: T1.1(S3) T1.7 U12.15(IN-) U12.16(IN-)
NetT1_3: T1.3(S1) T1.9 U12.13(IN+) U12.14(IN+)

Not connected (* = marked no-connect by the designer): U12 6(OUTF)* 7(OUTF)*

### Notes on the sheet
- Перв. примен.
- Справ. №
- Подп. и дата
- Инв. № дубл.
- Взам. инв. №
- Разраб.
- Изм.
- Лист
- № докум.
- Подп.
- Дата
- Лит.
- Масса
- Масштаб
- Пров.
- Т.контр.
- Листов
- Инв. № подл.
- Утв.
- Н.контр.
- 2.106-A3
- Копировал
- Формат А3

### Library data of the parts
C87-C93 C169-C171 C173 C174 = Capacitor: Manufacturer: *; Model: *; HelpURL: *; ComponentKind: *; Value: *
FB9 FB10 = FB-1
L2 L3 = Inductor-2
R16 R17 = Resistor: Manufacturer: *; Model: *; HelpURL: *; ComponentKind: *; Value: *
T1 = TRANSF_ACORE2: Transformer; Value: 1:4 ADT4-6T
U11 = LTC2208CUP

## Sheet MB_DAC.SchDoc
size 420 x 297 mm; Date: 18/12/2022; ApprovedBy: UA3REO; CheckedBy: UA3REO; Author: RU4PN; CompanyName: Wolf Team; DocumentNumber: Wolf2 MainBoard DAC; SheetNumber: 5; SheetTotal: 7
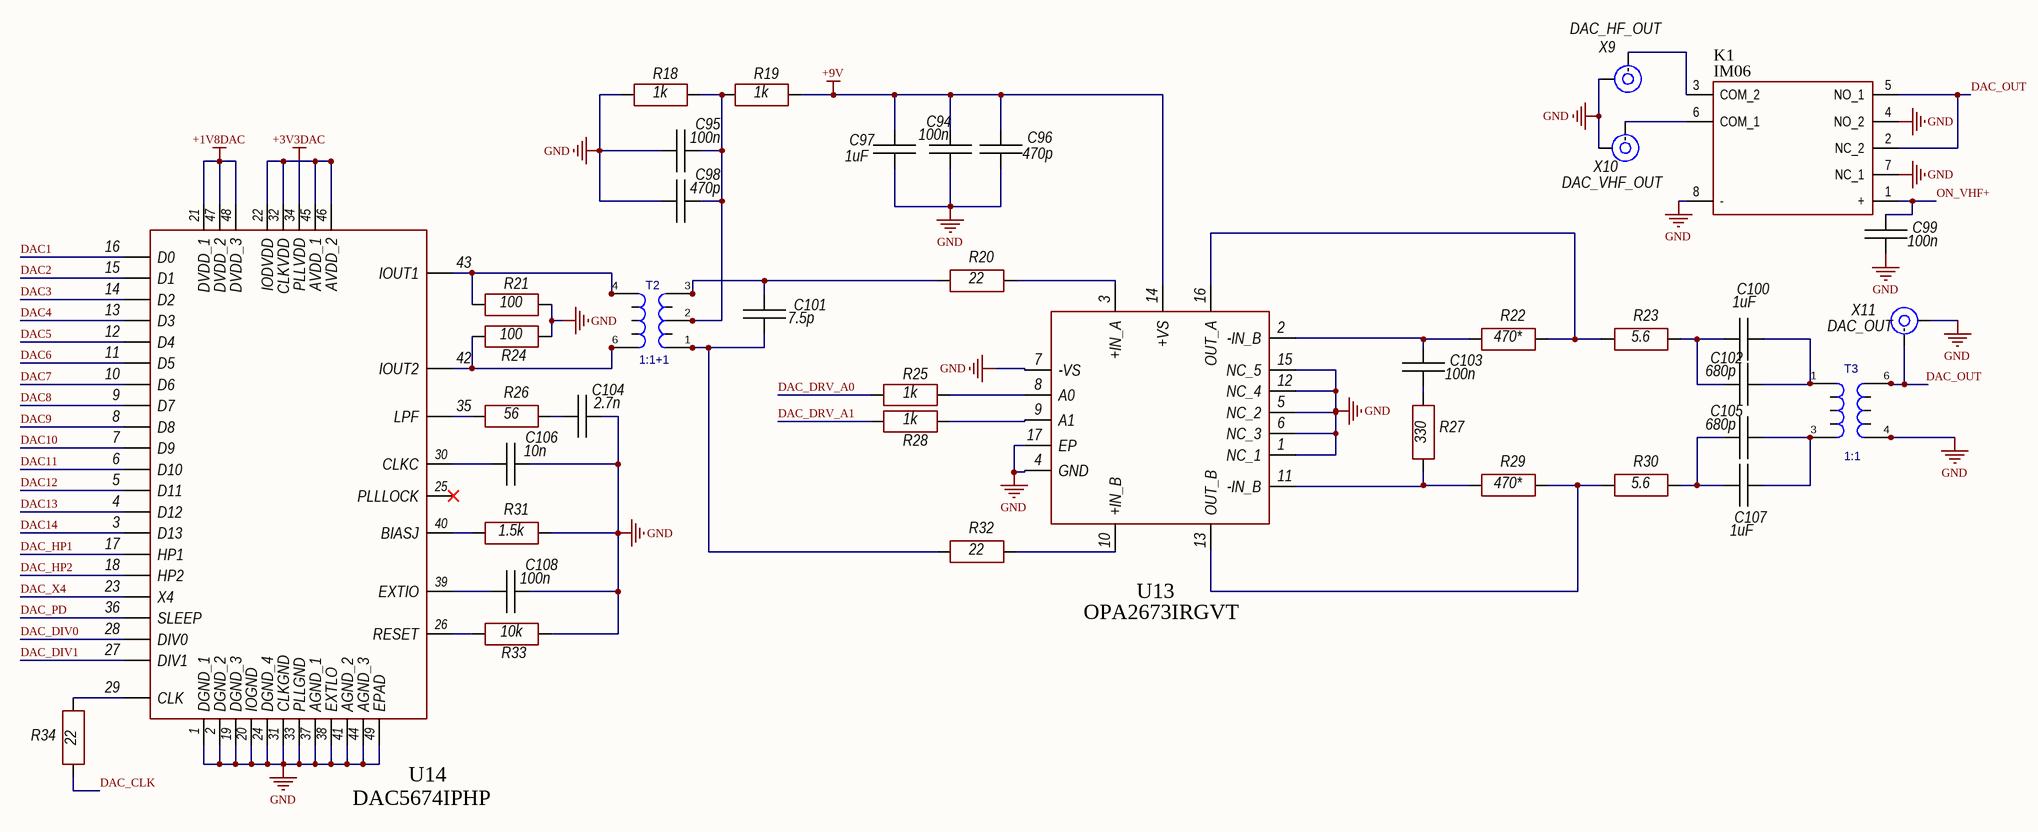
[diagram p4: MB_DAC.SchDoc]

### Parts
C94  100n  [CH0805C]
C95  100n  [CH0805C]
C96  470p  [CH0805C]
C97  1uF  [CH0805C]
C98  470p  [CH0805C]
C99  100n  [CH0805C]
C100  1uF  [CH0805C]
C101  7.5p  [CH0805C]
C102  680p  [CH0805C]
C103  100n  [CH0805C]
C104  2.7n  [CH0805C]
C105  680p  [CH0805C]
C106  10n  [CH0805C]
C107  1uF  [CH0805C]
C108  100n  [CH0805C]
K1  IM06  [IM06]
R18  1k  [CH0805R]
R19  1k  [CH0805R]
R20  22  [CH0805R]
R21  100  [CH0805R]
R22  470*  [CH0805R]
R23  5.6  [CH0805R]
R24  100  [CH0805R]
R25  1k  [CH0805R]
R26  56  [CH0805R]
R27  330  [CH0805R]
R28  1k  [CH0805R]
R29  470*  [CH0805R]
R30  5.6  [CH0805R]
R31  1.5k  [CH0805R]
R32  22  [CH0805R]
R33  10k  [CH0805R]
R34  22  [CH0805R]
T2  1:1+1  [TRANSF_ACORE2]
T3  1:1  [TRANSF_ACORE]
U13  OPA2673IRGVT  [16-QFN 4x4 PAD17]
U14  DAC5674IPHP  [48-TQFP]
X9  DAC_HF_OUT  [CON: SMA]
X10  DAC_VHF_OUT  [CON: SMA]
X11  DAC_OUT  [CON: SMA]

### Nets
+1V8DAC: U14.21(DVDD_1) U14.47(DVDD_2) U14.48(DVDD_3)
+3V3DAC: U14.22(IODVDD) U14.32(CLKVDD) U14.34(PLLVDD) U14.45(AVDD_1) U14.46(AVDD_2)
+9V: C94.2 C96.2 C97.2 R19.1 U13.14(+VS)
GND: C94.1 C95.1 C96.1 C97.1 C98.1 C99.1 C104.2 C106.2 C108.2 K1.4(NO_2) K1.7(NC_1) K1.8(-) R18.2 R21.1 R24.1 R31.1 R33.1 T3.4(S2) T3.11 U13.1(NC_1) U13.4(GND) U13.5(NC_2) U13.6(NC_3) U13.7(-VS) U13.12(NC_4) U13.15(NC_5) U13.17(EP) U14.1(DGND_1) U14.2(DGND_2) U14.19(DGND_3) U14.20(IOGND) U14.24(DGND_4) U14.31(CLKGND) U14.33(PLLGND) U14.37(AGND_1) U14.38(EXTLO) U14.41(AGND_2) U14.44(AGND_3) U14.49(EPAD) X9.2(IN) X10.2(IN) X11.2(IN)
DAC1: U14.16(D0)
DAC2: U14.15(D1)
DAC3: U14.14(D2)
DAC4: U14.13(D3)
DAC5: U14.12(D4)
DAC6: U14.11(D5)
DAC7: U14.10(D6)
DAC8: U14.9(D7)
DAC9: U14.8(D8)
DAC10: U14.7(D9)
DAC11: U14.6(D10)
DAC12: U14.5(D11)
DAC13: U14.4(D12)
DAC14: U14.3(D13)
DAC_CLK: R34.2
DAC_DIV0: U14.28(DIV0)
DAC_DIV1: U14.27(DIV1)
DAC_DRV_A0: R25.2
DAC_DRV_A1: R28.2
DAC_HP1: U14.17(HP1)
DAC_HP2: U14.18(HP2)
DAC_OUT: K1.2(NC_2) K1.5(NO_1) T3.6(S1) T3.10 X11.1(IN)
DAC_PD: U14.36(SLEEP)
DAC_X4: U14.23(X4)
ON_VHF+: C99.2 K1.1(+)
NetC95_2: C95.2 C98.2 R18.1 R19.2 T2.2(S2) T2.8
NetC100_1: C100.1 C102.1 T3.1(P1) T3.7
NetC100_2: C100.2 C102.2 R23.1
NetC101_1: C101.1 R20.2 T2.3(S1) T2.9
NetC101_2: C101.2 R32.2 T2.1(S3) T2.7
NetC103_1: C103.1 R27.1
NetC103_2: C103.2 R22.2 U13.2(-IN_B)
NetC104_1: C104.1 R26.1
NetC105_1: C105.1 C107.1 T3.3(P2) T3.9
NetC105_2: C105.2 C107.2 R30.1
NetC106_1: C106.1 U14.30(CLKC)
NetC108_1: C108.1 U14.39(EXTIO)
NetK1_3: K1.3(COM_2) X9.1(IN)
NetK1_6: K1.6(COM_1) X10.1(IN)
NetR20_1: R20.1 U13.3(+IN_A)
NetR21_2: R21.2 T2.4(P1) T2.11 U14.43(IOUT1)
NetR22_1: R22.1 R23.2 U13.16(OUT_A)
NetR24_2: R24.2 T2.6(P2) T2.10 U14.42(IOUT2)
NetR25_1: R25.1 U13.8(A0)
NetR26_2: R26.2 U14.35(LPF)
NetR27_2: R27.2 R29.2 U13.11(-IN_B)
NetR28_1: R28.1 U13.9(A1)
NetR29_1: R29.1 R30.2 U13.13(OUT_B)
NetR31_2: R31.2 U14.40(BIASJ)
NetR32_1: R32.1 U13.10(+IN_B)
NetR33_2: R33.2 U14.26(RESET)
NetR34_1: R34.1 U14.29(CLK)

Not connected (* = marked no-connect by the designer): T3 8(0); U14 25(PLLLOCK)*

### Notes on the sheet
- Перв. примен.
- Справ. №
- Подп. и дата
- Инв. № дубл.
- Взам. инв. №
- Разраб.
- Изм.
- Лист
- № докум.
- Подп.
- Дата
- Лит.
- Масса
- Масштаб
- Пров.
- Т.контр.
- Листов
- Инв. № подл.
- Утв.
- Н.контр.
- 2.106-A3
- Копировал
- Формат А3

### Library data of the parts
C94-C108 = Capacitor: Manufacturer: *; Model: *; HelpURL: *; ComponentKind: *; Value: *
K1 = IM06-V1
R18-R34 = Resistor: Manufacturer: *; Model: *; HelpURL: *; ComponentKind: *; Value: *
T2 = TRANSF_ACORE2: Transformer; Value: 1:1+1
T3 = TRANSF_ACORE: Transformer; Value: 1:1
X9-X11 = SMA: RF; Model: *; Manufacturer: *; HelpURL: *; ComponentKind: *

## Sheet MB_RF.SchDoc
size 420 x 297 mm; Date: 18/12/2022; ApprovedBy: UA3REO; CheckedBy: UA3REO; Author: RU4PN; CompanyName: Wolf Team; DocumentNumber: Wolf2 MainBoard RF; SheetNumber: 6; SheetTotal: 7
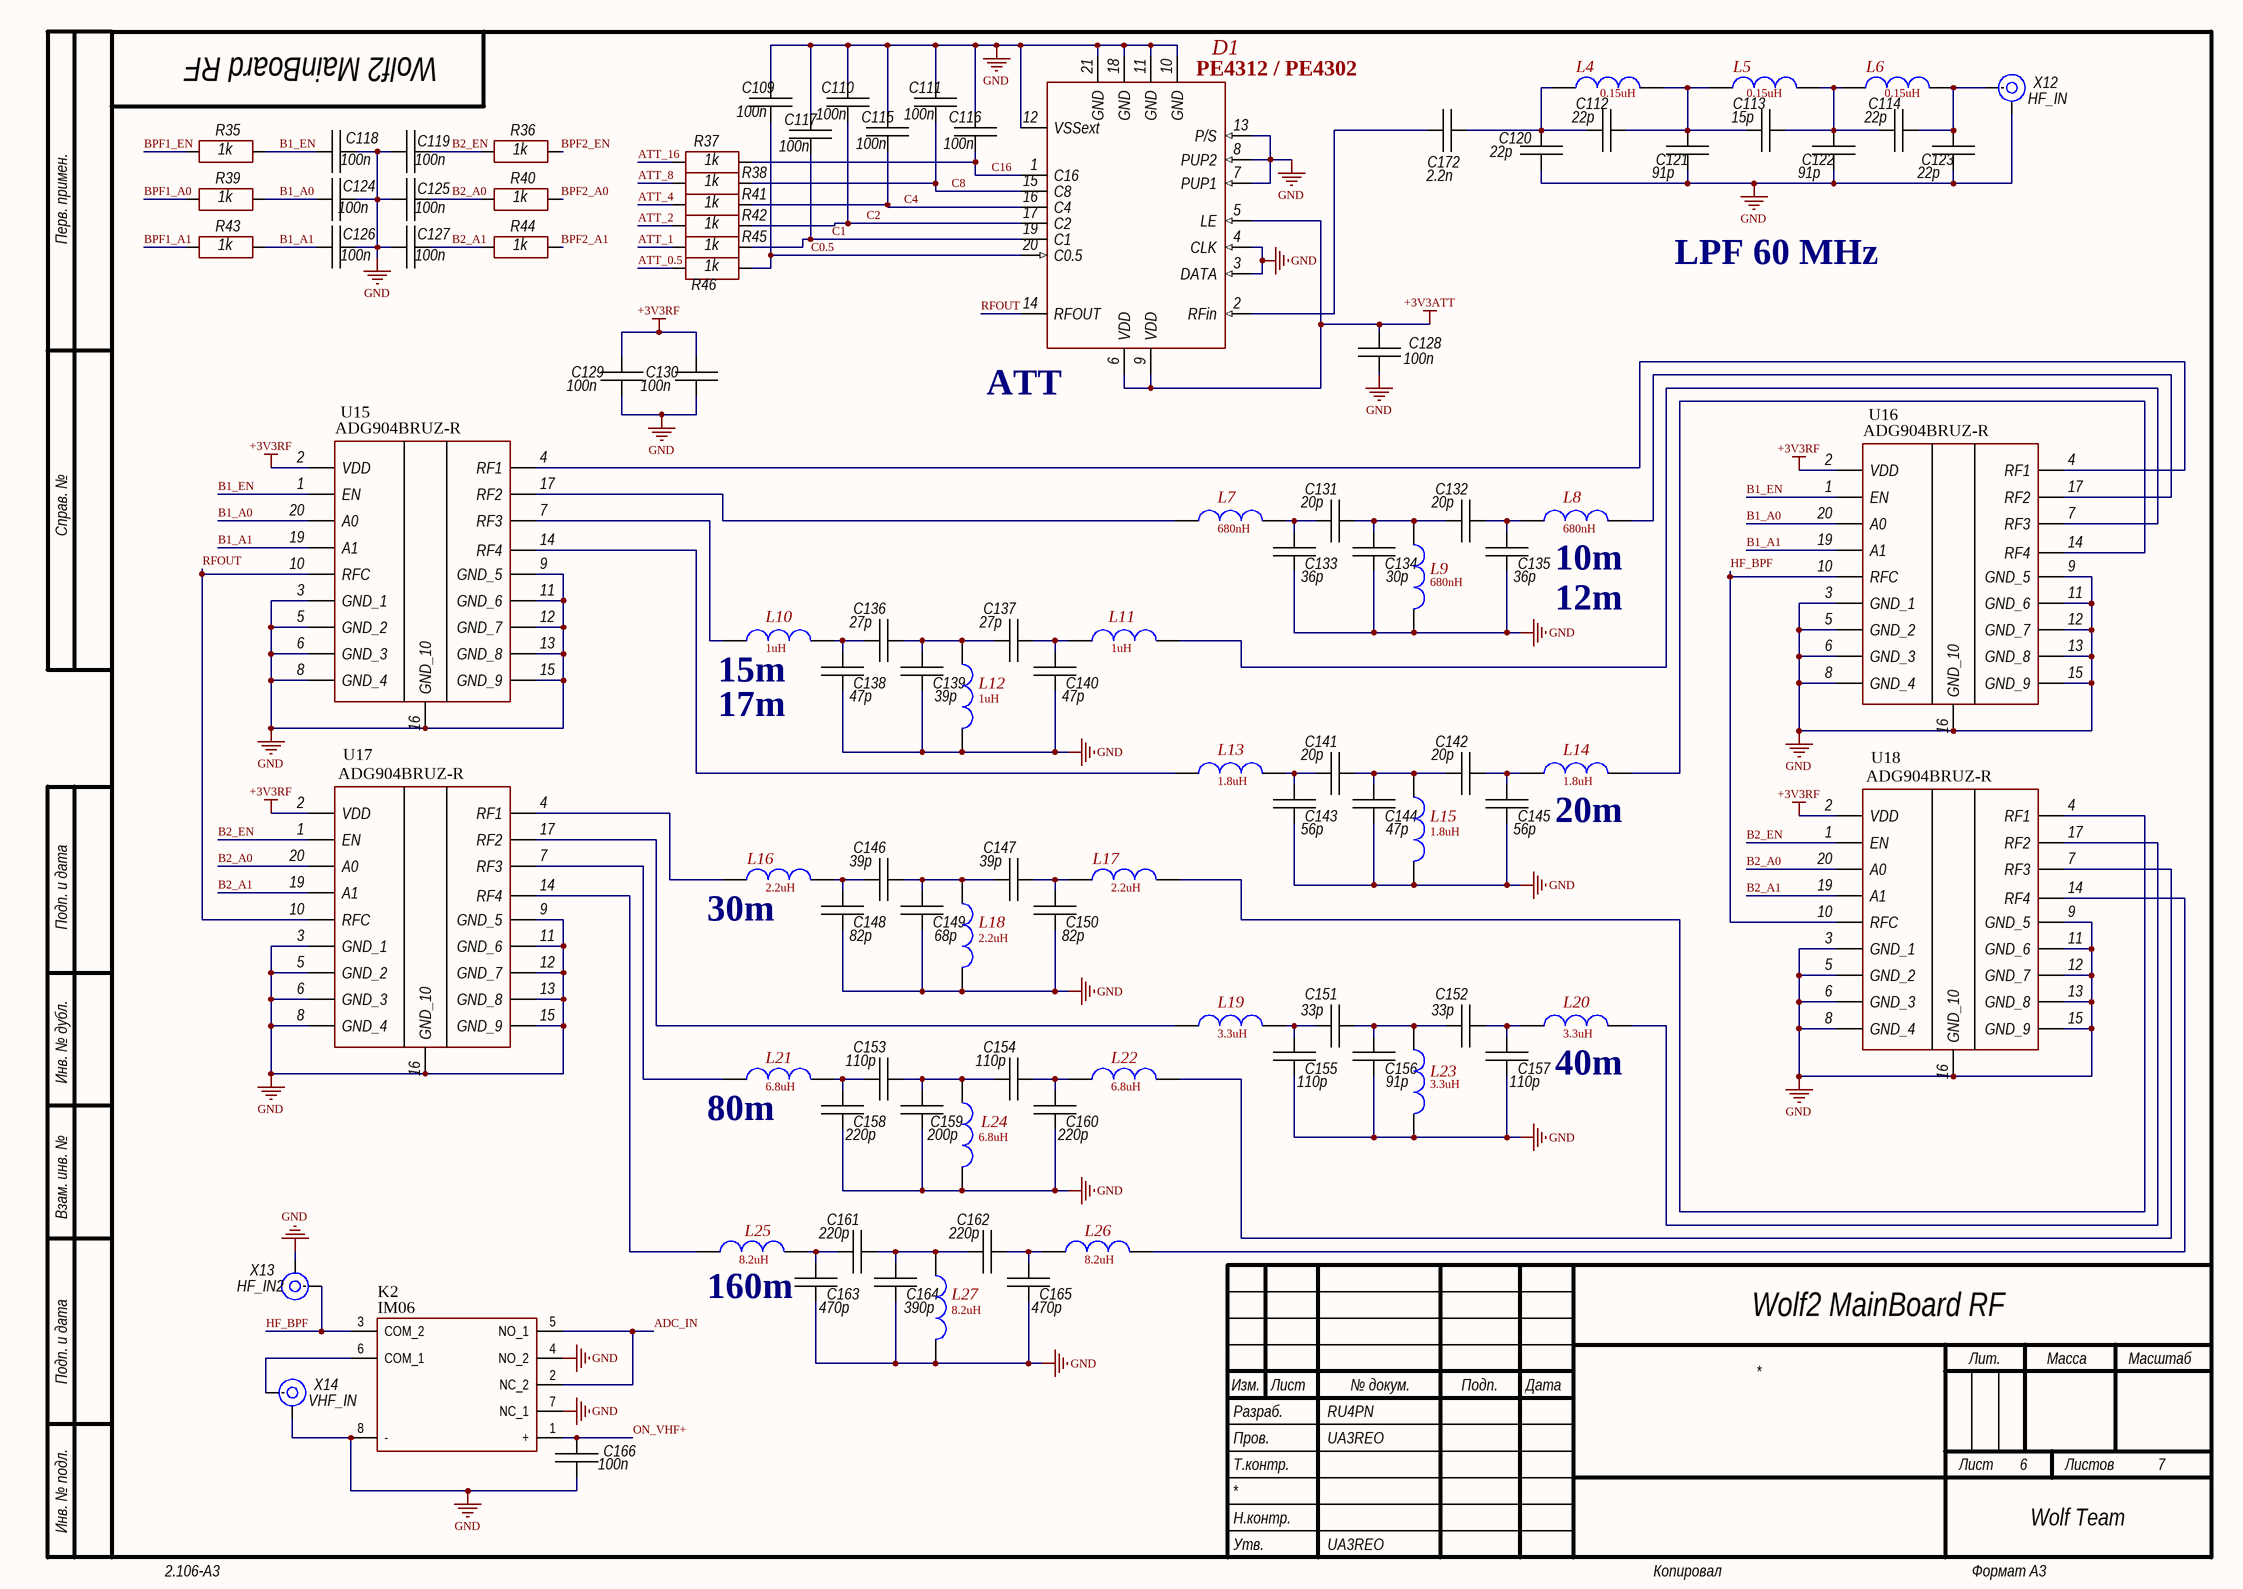
[diagram p5: MB_RF.SchDoc]

### Parts
C109  100n  [CH0805C]
C110  100n  [CH0805C]
C111  100n  [CH0805C]
C112  22p  [CH0805C]
C113  15p  [CH0805C]
C114  22p  [CH0805C]
C115  100n  [CH0805C]
C116  100n  [CH0805C]
C117  100n  [CH0805C]
C118  100n  [CH0805C]
C119  100n  [CH0805C]
C120  22p  [CH0805C]
C121  91p  [CH0805C]
C122  91p  [CH0805C]
C123  22p  [CH0805C]
C124  100n  [CH0805C]
C125  100n  [CH0805C]
C126  100n  [CH0805C]
C127  100n  [CH0805C]
C128  100n  [CH0805C]
C129  100n  [CH0805C]
C130  100n  [CH0805C]
C131  20p  [CH0805C]
C132  20p  [CH0805C]
C133  36p  [CH0805C]
C134  30p  [CH0805C]
C135  36p  [CH0805C]
C136  27p  [CH0805C]
C137  27p  [CH0805C]
C138  47p  [CH0805C]
C139  39p  [CH0805C]
C140  47p  [CH0805C]
C141  20p  [CH0805C]
C142  20p  [CH0805C]
C143  56p  [CH0805C]
C144  47p  [CH0805C]
C145  56p  [CH0805C]
C146  39p  [CH0805C]
C147  39p  [CH0805C]
C148  82p  [CH0805C]
C149  68p  [CH0805C]
C150  82p  [CH0805C]
C151  33p  [CH0805C]
C152  33p  [CH0805C]
C153  110p  [CH0805C]
C154  110p  [CH0805C]
C155  110p  [CH0805C]
C156  91p  [CH0805C]
C157  110p  [CH0805C]
C158  220p  [CH0805C]
C159  200p  [CH0805C]
C160  220p  [CH0805C]
C161  220p  [CH0805C]
C162  220p  [CH0805C]
C163  470p  [CH0805C]
C164  390p  [CH0805C]
C165  470p  [CH0805C]
C166  100n  [CH0805C]
C172  2.2n  [CH0805C]
D1  PE4312 / PE4302  [20-QFN (4x4)]
K2  IM06  [IM06]
L4  0.15uH  [CH0805L]
L5  0.15uH  [CH0805L]
L6  0.15uH  [CH0805L]
L7  680nH  [CH0805L]
L8  680nH  [CH0805L]
L9  680nH  [CH0805L]
L10  1uH  [CH0805L]
L11  1uH  [CH0805L]
L12  1uH  [CH0805L]
L13  1.8uH  [CH0805L]
L14  1.8uH  [CH0805L]
L15  1.8uH  [CH0805L]
L16  2.2uH  [CH0805L]
L17  2.2uH  [CH0805L]
L18  2.2uH  [CH0805L]
L19  3.3uH  [CH0805L]
L20  3.3uH  [CH0805L]
L21  6.8uH  [CH0805L]
L22  6.8uH  [CH0805L]
L23  3.3uH  [CH0805L]
L24  6.8uH  [CH0805L]
L25  8.2uH  [CH0805L]
L26  8.2uH  [CH0805L]
L27  8.2uH  [CH0805L]
R35  1k  [CH0805R]
R36  1k  [CH0805R]
R37  1k  [CH0805R]
R38  1k  [CH0805R]
R39  1k  [CH0805R]
R40  1k  [CH0805R]
R41  1k  [CH0805R]
R42  1k  [CH0805R]
R43  1k  [CH0805R]
R44  1k  [CH0805R]
R45  1k  [CH0805R]
R46  1k  [CH0805R]
U15  ADG904BRUZ-R  [20-TSSOP]
U16  ADG904BRUZ-R  [20-TSSOP]
U17  ADG904BRUZ-R  [20-TSSOP]
U18  ADG904BRUZ-R  [20-TSSOP]
X12  HF_IN  [CON: SMA]
X13  HF_IN2  [CON: SMA]
X14  VHF_IN  [CON: SMA]

### Nets
+3V3ATT: C128.1 D1.5(LE) D1.6(VDD) D1.9(VDD)
+3V3RF: C129.1 C130.1 U15.2(VDD) U16.2(VDD) U17.2(VDD) U18.2(VDD)
GND: C109.1 C110.1 C111.1 C115.1 C116.1 C117.1 C118.2 C119.1 C120.2 C121.2 C122.2 C123.2 C124.2 C125.1 C126.2 C127.1 C128.2 C129.2 C130.2 C133.1 C134.1 C135.1 C138.1 C139.1 C140.1 C143.1 C144.1 C145.1 C148.1 C149.1 C150.1 C155.1 C156.1 C157.1 C158.1 C159.1 C160.1 C163.1 C164.1 C165.1 C166.1 D1.3(DATA) D1.4(CLK) D1.7(PUP1) D1.8(PUP2) D1.10(GND) D1.11(GND) D1.12(VSSext) D1.13(P/S) D1.18(GND) D1.21(GND) K2.4(NO_2) K2.7(NC_1) K2.8(-) L9.1 L12.1 L15.1 L18.1 L23.1 L24.1 L27.1 U15.3(GND_1) U15.5(GND_2) U15.6(GND_3) U15.8(GND_4) U15.9(GND_5) U15.11(GND_6) U15.12(GND_7) U15.13(GND_8) U15.15(GND_9) U15.16(GND_10) U16.3(GND_1) U16.5(GND_2) U16.6(GND_3) U16.8(GND_4) U16.9(GND_5) U16.11(GND_6) U16.12(GND_7) U16.13(GND_8) U16.15(GND_9) U16.16(GND_10) U17.3(GND_1) U17.5(GND_2) U17.6(GND_3) U17.8(GND_4) U17.9(GND_5) U17.11(GND_6) U17.12(GND_7) U17.13(GND_8) U17.15(GND_9) U17.16(GND_10) U18.3(GND_1) U18.5(GND_2) U18.6(GND_3) U18.8(GND_4) U18.9(GND_5) U18.11(GND_6) U18.12(GND_7) U18.13(GND_8) U18.15(GND_9) U18.16(GND_10) X12.2(IN) X13.2(IN) X14.2(IN)
ADC_IN: K2.2(NC_2) K2.5(NO_1)
ATT_0.5: R46.2
ATT_1: R45.2
ATT_2: R42.2
ATT_4: R41.2
ATT_8: R38.2
ATT_16: R37.2
B1_A0: C124.1 R39.1 U15.20(A0) U16.20(A0)
B1_A1: C126.1 R43.1 U15.19(A1) U16.19(A1)
B1_EN: C118.1 R35.1 U15.1(EN) U16.1(EN)
B2_A0: C125.2 R40.2 U17.20(A0) U18.20(A0)
B2_A1: C127.2 R44.2 U17.19(A1) U18.19(A1)
B2_EN: C119.2 R36.2 U17.1(EN) U18.1(EN)
BPF1_A0: R39.2
BPF1_A1: R43.2
BPF1_EN: R35.2
BPF2_A0: R40.1
BPF2_A1: R44.1
BPF2_EN: R36.1
C0.5: C109.2 D1.20(С0.5) R46.1
C1: C117.2 D1.19(C1) R45.1
C2: C110.2 D1.17(C2) R42.1
C4: C115.2 D1.16(C4) R41.1
C8: C111.2 D1.15(C8) R38.1
C16: C116.2 D1.1(C16) R37.1
HF_BPF: K2.3(COM_2) U16.10(RFC) U18.10(RFC) X13.1(IN)
ON_VHF+: C166.2 K2.1(+)
RFOUT: D1.14(RFOUT) U15.10(RFC) U17.10(RFC)
NetC112_1: C112.1 C120.1 C172.2 L4.2
NetC112_2: C112.2 C113.1 C121.1 L4.1 L5.2
NetC113_2: C113.2 C114.1 C122.1 L5.1 L6.2
NetC114_2: C114.2 C123.1 L6.1 X12.1(IN)
NetC131_1: C131.1 C132.2 C134.2 L9.2
NetC131_2: C131.2 C133.2 L7.1
NetC132_1: C132.1 C135.2 L8.2
NetC136_1: C136.1 C137.2 C139.2 L12.2
NetC136_2: C136.2 C138.2 L10.1
NetC137_1: C137.1 C140.2 L11.2
NetC141_1: C141.1 C142.2 C144.2 L15.2
NetC141_2: C141.2 C143.2 L13.1
NetC142_1: C142.1 C145.2 L14.2
NetC146_1: C146.1 C147.2 C149.2 L18.2
NetC146_2: C146.2 C148.2 L16.1
NetC147_1: C147.1 C150.2 L17.2
NetC151_1: C151.1 C152.2 C156.2 L23.2
NetC151_2: C151.2 C155.2 L19.1
NetC152_1: C152.1 C157.2 L20.2
NetC153_1: C153.1 C154.2 C159.2 L24.2
NetC153_2: C153.2 C158.2 L21.1
NetC154_1: C154.1 C160.2 L22.2
NetC161_1: C161.1 C162.2 C164.2 L27.2
NetC161_2: C161.2 C163.2 L25.1
NetC162_1: C162.1 C165.2 L26.2
NetC172_1: C172.1 D1.2(RFin)
NetK2_6: K2.6(COM_1) X14.1(IN)
NetL7_2: L7.2 U15.17(RF2)
NetL8_1: L8.1 U16.17(RF2)
NetL10_2: L10.2 U15.7(RF3)
NetL11_1: L11.1 U16.7(RF3)
NetL13_2: L13.2 U15.14(RF4)
NetL14_1: L14.1 U16.14(RF4)
NetL16_2: L16.2 U17.4(RF1)
NetL17_1: L17.1 U18.4(RF1)
NetL19_2: L19.2 U17.17(RF2)
NetL20_1: L20.1 U18.17(RF2)
NetL21_2: L21.2 U17.7(RF3)
NetL22_1: L22.1 U18.7(RF3)
NetL25_2: L25.2 U17.14(RF4)
NetL26_1: L26.1 U18.14(RF4)
NetU15_4: U15.4(RF1) U16.4(RF1)

### Notes on the sheet
- LPF 60 MHz
- (near D1) ATT
- (near L8) 10m
- 12m
- (near L10) 15m
- (near L10) 17m
- (near L14) 20m
- (near L16) 30m
- (near L21) 80m
- (near L20) 40m
- (near L25) 160m
- Перв. примен.
- Справ. №
- Подп. и дата
- Инв. № дубл.
- Взам. инв. №
- Разраб.
- Изм.
- Лист
- № докум.
- Подп.
- Дата
- Лит.
- Масса
- Масштаб
- Пров.
- Т.контр.
- Листов
- Инв. № подл.
- Утв.
- Н.контр.
- 2.106-A3
- Копировал
- Формат А3

### Library data of the parts
C109-C166 C172 = Capacitor: Manufacturer: *; Model: *; HelpURL: *; ComponentKind: *; Value: *
D1 = PE4312-№1
K2 = IM06-V1
L4-L27 = Inductor-2
R35-R46 = Resistor: Manufacturer: *; Model: *; HelpURL: *; ComponentKind: *; Value: *
X12-X14 = SMA: RF; Model: *; Manufacturer: *; HelpURL: *; ComponentKind: *

## Sheet MB_Control.SchDoc
size 420 x 297 mm; Date: 04/03/2023; ApprovedBy: UA3REO; CheckedBy: UA3REO; Author: RU4PN; CompanyName: Wolf Team; DocumentNumber: Wolf2 MainBoard Control; SheetNumber: 7; SheetTotal: 7
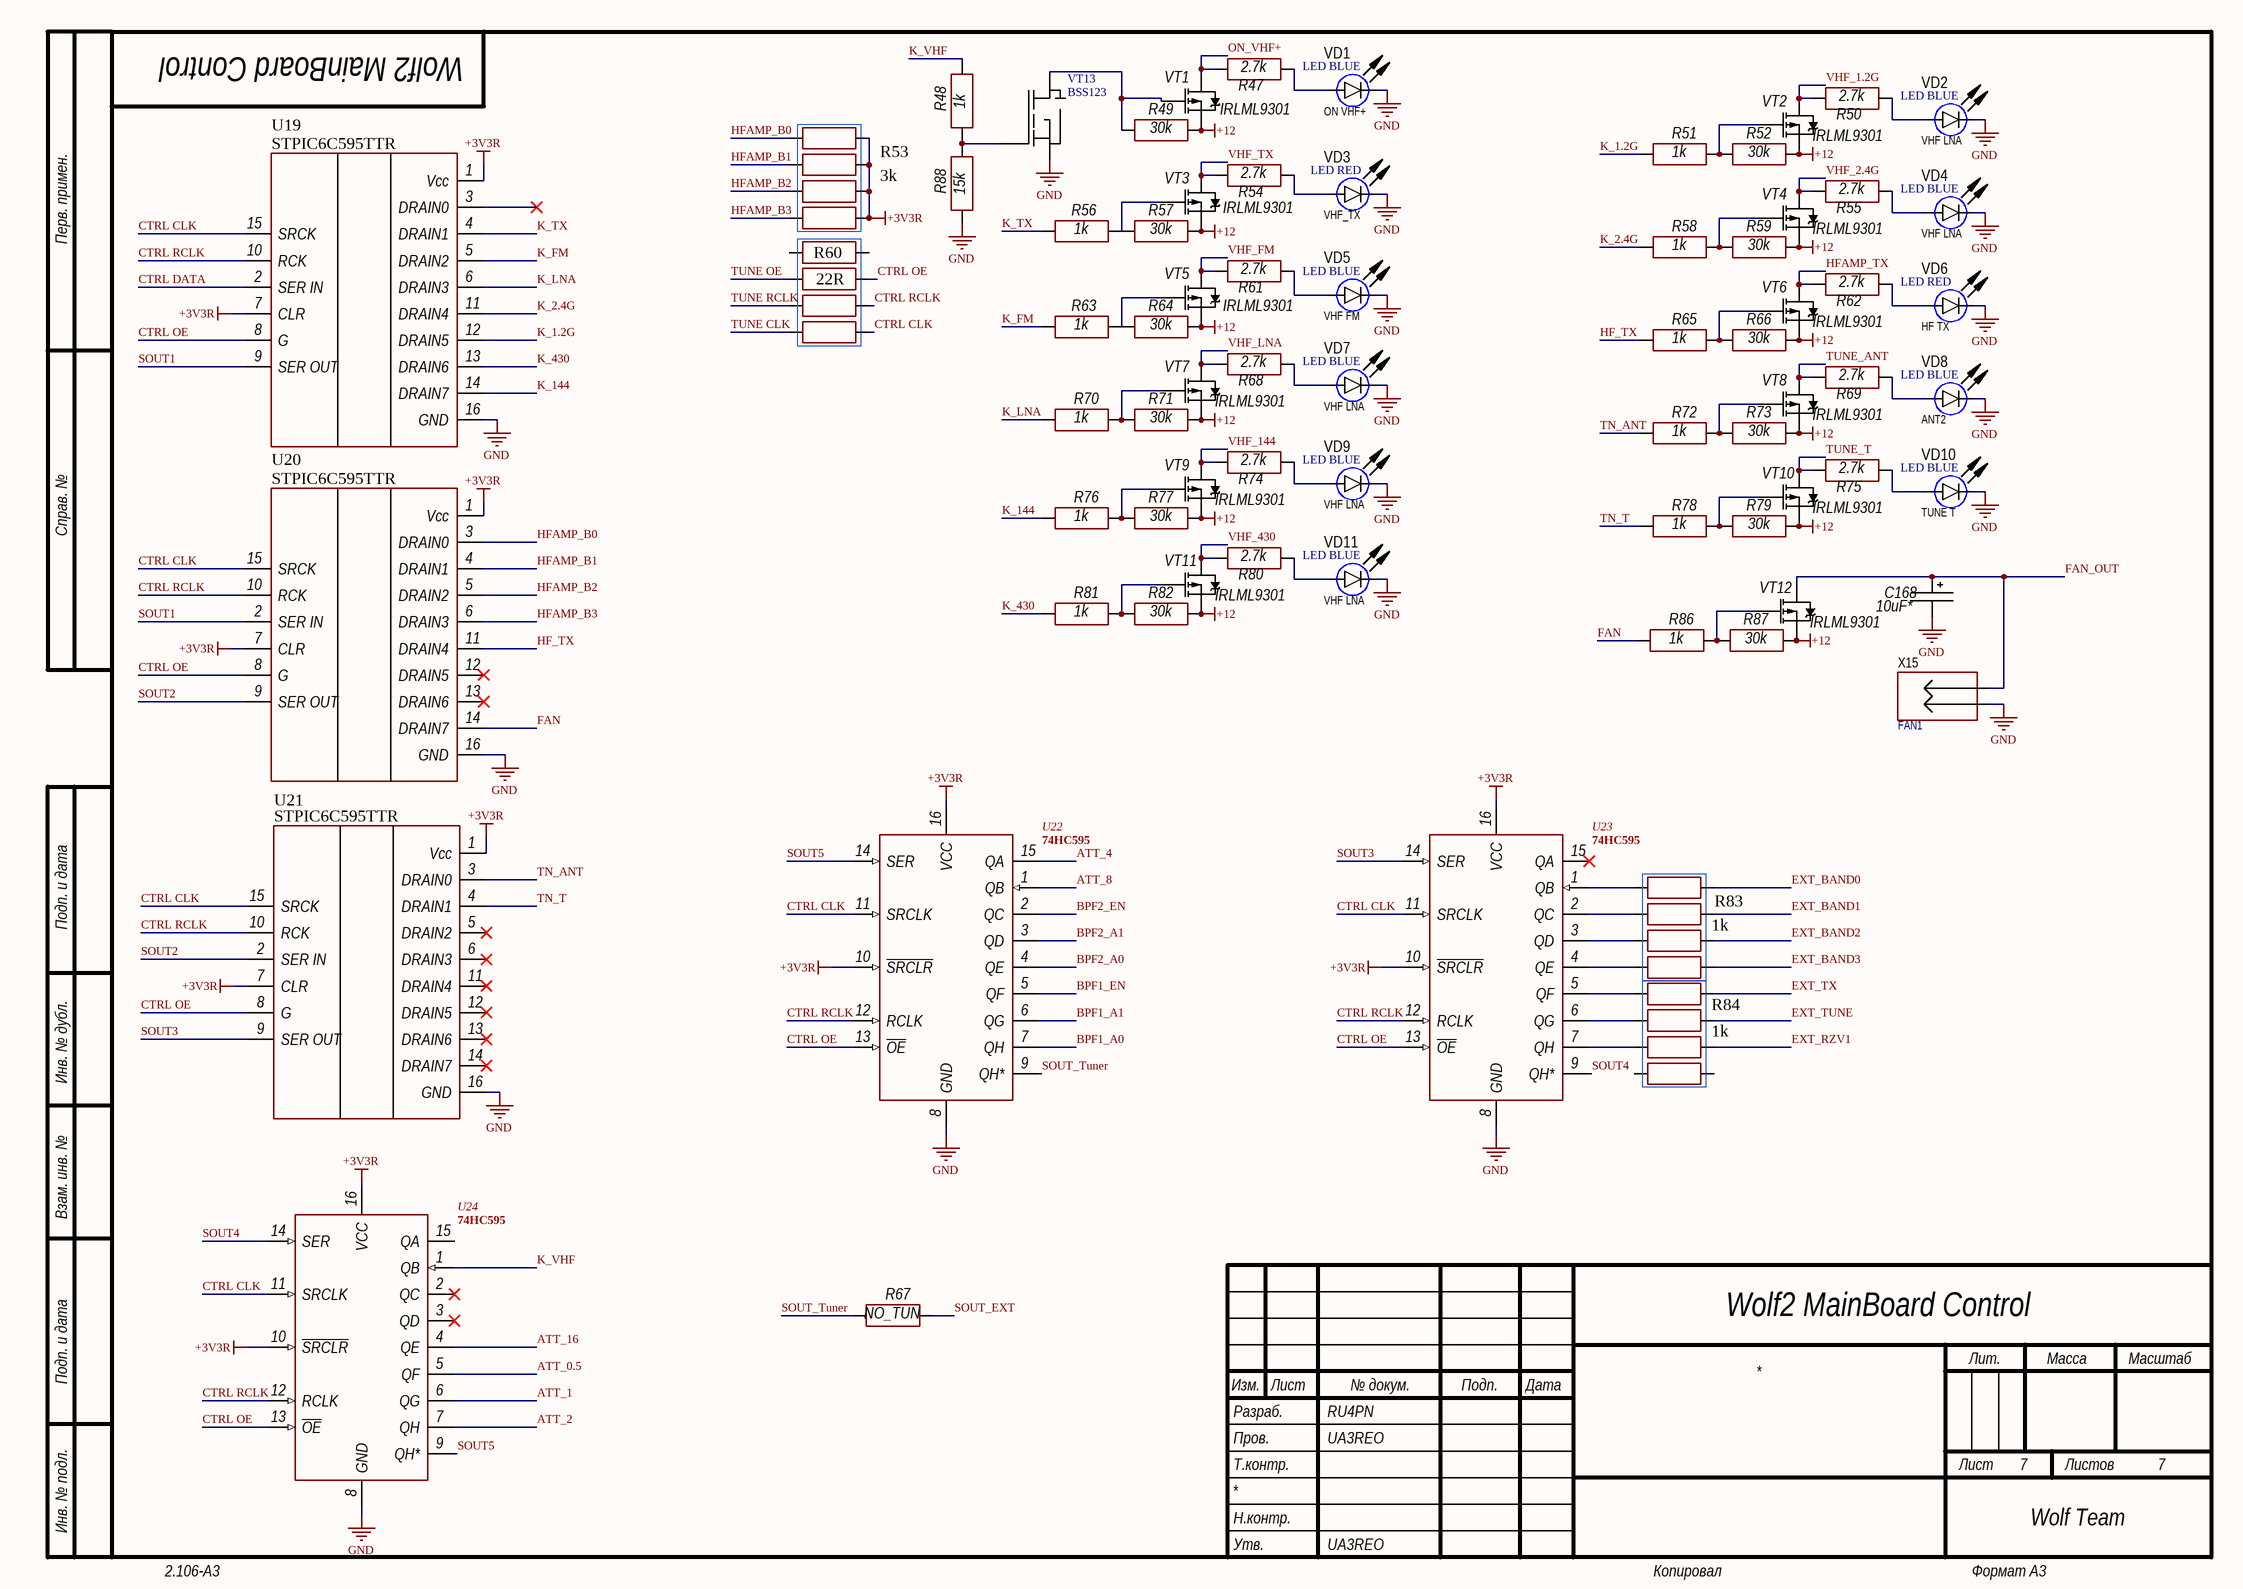
[diagram p6: MB_Control.SchDoc]

### Parts
C168  10uF*  [TANTAL_B]
R47  2.7k  [CH0805R]
R48  1k  [CH0805R]
R49  30k  [CH0805R]
R50  2.7k  [CH0805R]
R51  1k  [CH0805R]
R52  30k  [CH0805R]
R53  3k  [CAT16]
R54  2.7k  [CH0805R]
R55  2.7k  [CH0805R]
R56  1k  [CH0805R]
R57  30k  [CH0805R]
R58  1k  [CH0805R]
R59  30k  [CH0805R]
R60  22R  [CAT16]
R61  2.7k  [CH0805R]
R62  2.7k  [CH0805R]
R63  1k  [CH0805R]
R64  30k  [CH0805R]
R65  1k  [CH0805R]
R66  30k  [CH0805R]
R67  NO_TUN  [CH0805R]
R68  2.7k  [CH0805R]
R69  2.7k  [CH0805R]
R70  1k  [CH0805R]
R71  30k  [CH0805R]
R72  1k  [CH0805R]
R73  30k  [CH0805R]
R74  2.7k  [CH0805R]
R75  2.7k  [CH0805R]
R76  1k  [CH0805R]
R77  30k  [CH0805R]
R78  1k  [CH0805R]
R79  30k  [CH0805R]
R80  2.7k  [CH0805R]
R81  1k  [CH0805R]
R82  30k  [CH0805R]
R83  1k  [CAT16]
R84  1k  [CAT16]
R86  1k  [CH0805R]
R87  30k  [CH0805R]
R88  15k  [CH0805R]
U19  STPIC6C595TTR  [16-TSOP]
U20  STPIC6C595TTR  [16-TSOP]
U21  STPIC6C595TTR  [16-TSOP]
U22  74HC595  [16-SO]
U23  74HC595  [16-SO]
U24  74HC595  [16-SO]
VD1  LED BLUE  Color: ON VHF+  [LED: 0805B]
VD2  LED BLUE  Color: VHF LNA  [LED: 0805B]
VD3  LED RED  Color: VHF_TX  [LED: 0805R]
VD4  LED BLUE  Color: VHF LNA  [LED: 0805B]
VD5  LED BLUE  Color: VHF FM  [LED: 0805B]
VD6  LED RED  Color: HF TX  [LED: 0805R]
VD7  LED BLUE  Color: VHF LNA  [LED: 0805B]
VD8  LED BLUE  Color: ANT2  [LED: 0805B]
VD9  LED BLUE  Color: VHF LNA  [LED: 0805B]
VD10  LED BLUE  Color: TUNE T  [LED: 0805B]
VD11  LED BLUE  Color: VHF LNA  [LED: 0805B]
VT1  IRLML9301  [SOT23_132]
VT2  IRLML9301  [SOT23_132]
VT3  IRLML9301  [SOT23_132]
VT4  IRLML9301  [SOT23_132]
VT5  IRLML9301  [SOT23_132]
VT6  IRLML9301  [SOT23_132]
VT7  IRLML9301  [SOT23_132]
VT8  IRLML9301  [SOT23_132]
VT9  IRLML9301  [SOT23_132]
VT10  IRLML9301  [SOT23_132]
VT11  IRLML9301  [SOT23_132]
VT12  IRLML9301  [SOT23_132]
VT13  BSS123  [SOT23_132]
X15  FAN1  [CON: CWF-2]

### Nets
+3V3R: R53.5 R53.6 R53.7 R53.8 U19.1(Vcc) U19.7(CLR) U20.1(Vcc) U20.7(CLR) U21.1(Vcc) U21.7(CLR) U22.10(~{SRCLR}) U22.16(VCC) U23.10(~{SRCLR}) U23.16(VCC) U24.10(~{SRCLR}) U24.16(VCC)
+12: R49.1 R52.1 R57.1 R59.1 R64.1 R66.1 R71.1 R73.1 R77.1 R79.1 R82.1 R87.1 VT1.2(S) VT2.2(S) VT3.2(S) VT4.2(S) VT5.2(S) VT6.2(S) VT7.2(S) VT8.2(S) VT9.2(S) VT10.2(S) VT11.2(S) VT12.2(S)
GND: C168.2 R88.2 U19.16(GND) U20.16(GND) U21.16(GND) U22.8(GND) U23.8(GND) U24.8(GND) VD1.2(C) VD2.2(C) VD3.2(C) VD4.2(C) VD5.2(C) VD6.2(C) VD7.2(C) VD8.2(C) VD9.2(C) VD10.2(C) VD11.2(C) VT13.2(S) X15.2
ATT_0.5: U24.5(QF)
ATT_1: U24.6(QG)
ATT_2: U24.7(QH)
ATT_4: U22.15(QA)
ATT_8: U22.1(QB)
ATT_16: U24.4(QE)
BPF1_A0: U22.7(QH)
BPF1_A1: U22.6(QG)
BPF1_EN: U22.5(QF)
BPF2_A0: U22.4(QE)
BPF2_A1: U22.3(QD)
BPF2_EN: U22.2(QC)
CTRL CLK: R60.8 U19.15(SRCK) U20.15(SRCK) U21.15(SRCK) U22.11(SRCLK) U23.11(SRCLK) U24.11(SRCLK)
CTRL DATA: U19.2(SER_IN)
CTRL OE: R60.6 U19.8(G) U20.8(G) U21.8(G) U22.13(~{OE}) U23.13(~{OE}) U24.13(~{OE})
CTRL RCLK: R60.7 U19.10(RCK) U20.10(RCK) U21.10(RCK) U22.12(RCLK) U23.12(RCLK) U24.12(RCLK)
EXT_BAND0: R83.5
EXT_BAND1: R83.6
EXT_BAND2: R83.7
EXT_BAND3: R83.8
EXT_RZV1: R84.7
EXT_TUNE: R84.6
EXT_TX: R84.5
FAN: R86.2 U20.14(DRAIN7)
FAN_OUT: C168.1 VT12.3(D) X15.1
HF_TX: R65.2 U20.11(DRAIN4)
HFAMP_B0: R53.1 U20.3(DRAIN0)
HFAMP_B1: R53.2 U20.4(DRAIN1)
HFAMP_B2: R53.3 U20.5(DRAIN2)
HFAMP_B3: R53.4 U20.6(DRAIN3)
HFAMP_TX: R62.2 VT6.3(D)
K_1.2G: R51.2 U19.12(DRAIN5)
K_2.4G: R58.2 U19.11(DRAIN4)
K_144: R76.2 U19.14(DRAIN7)
K_430: R81.2 U19.13(DRAIN6)
K_FM: R63.2 U19.5(DRAIN2)
K_LNA: R70.2 U19.6(DRAIN3)
K_TX: R56.2 U19.4(DRAIN1)
K_VHF: R48.1 U24.1(QB)
ON_VHF+: R47.2 VT1.3(D)
SOUT1: U19.9(SER_OUT) U20.2(SER_IN)
SOUT2: U20.9(SER_OUT) U21.2(SER_IN)
SOUT3: U21.9(SER_OUT) U23.14(SER)
SOUT4: U23.9(QH*) U24.14(SER)
SOUT5: U22.14(SER) U24.9(QH*)
SOUT_EXT: R67.1
SOUT_Tuner: R67.2 U22.9(QH*)
TN_ANT: R72.2 U21.3(DRAIN0)
TN_T: R78.2 U21.4(DRAIN1)
TUNE CLK: R60.4
TUNE OE: R60.2
TUNE RCLK: R60.3
TUNE_ANT: R69.2 VT8.3(D)
TUNE_T: R75.2 VT10.3(D)
VHF_1.2G: R50.2 VT2.3(D)
VHF_2.4G: R55.2 VT4.3(D)
VHF_144: R74.2 VT9.3(D)
VHF_430: R80.2 VT11.3(D)
VHF_FM: R61.2 VT5.3(D)
VHF_LNA: R68.2 VT7.3(D)
VHF_TX: R54.2 VT3.3(D)
NetR47_1: R47.1 VD1.1(A)
NetR48_2: R48.2 R88.1 VT13.1(G)
NetR49_2: R49.2 VT1.1(G) VT13.3(D)
NetR50_1: R50.1 VD2.1(A)
NetR51_1: R51.1 R52.2 VT2.1(G)
NetR54_1: R54.1 VD3.1(A)
NetR55_1: R55.1 VD4.1(A)
NetR56_1: R56.1 R57.2 VT3.1(G)
NetR58_1: R58.1 R59.2 VT4.1(G)
NetR61_1: R61.1 VD5.1(A)
NetR62_1: R62.1 VD6.1(A)
NetR63_1: R63.1 R64.2 VT5.1(G)
NetR65_1: R65.1 R66.2 VT6.1(G)
NetR68_1: R68.1 VD7.1(A)
NetR69_1: R69.1 VD8.1(A)
NetR70_1: R70.1 R71.2 VT7.1(G)
NetR72_1: R72.1 R73.2 VT8.1(G)
NetR74_1: R74.1 VD9.1(A)
NetR75_1: R75.1 VD10.1(A)
NetR76_1: R76.1 R77.2 VT9.1(G)
NetR78_1: R78.1 R79.2 VT10.1(G)
NetR80_1: R80.1 VD11.1(A)
NetR81_1: R81.1 R82.2 VT11.1(G)
NetR83_1: R83.1 U23.1(QB)
NetR83_2: R83.2 U23.2(QC)
NetR83_3: R83.3 U23.3(QD)
NetR83_4: R83.4 U23.4(QE)
NetR84_1: R84.1 U23.5(QF)
NetR84_2: R84.2 U23.6(QG)
NetR84_3: R84.3 U23.7(QH)
NetR86_1: R86.1 R87.2 VT12.1(G)

Not connected (* = marked no-connect by the designer): R60 1 5; R84 4 8; U19 3(DRAIN0)*; U20 12(DRAIN5)* 13(DRAIN6)*; U21 5(DRAIN2)* 6(DRAIN3)* 11(DRAIN4)* 12(DRAIN5)* 13(DRAIN6)* 14(DRAIN7)*; U23 15(QA)*; U24 2(QC)* 3(QD)* 15(QA)

### Notes on the sheet
- Перв. примен.
- Справ. №
- Подп. и дата
- Инв. № дубл.
- Взам. инв. №
- Разраб.
- Изм.
- Лист
- № докум.
- Подп.
- Дата
- Лит.
- Масса
- Масштаб
- Пров.
- Т.контр.
- Листов
- Инв. № подл.
- Утв.
- Н.контр.
- 2.106-A3
- Копировал
- Формат А3

### Library data of the parts
C168 = TantalCap: Manufacturer: *; Model: *; HelpURL: *; ComponentKind: *; Value: *
R47-R52 R54-R59 R61-R82 R86-R88 = Resistor: Manufacturer: *; Model: *; HelpURL: *; ComponentKind: *; Value: *
R53 R60 R83 R84 = CAT10-0804
U22-U24 = HC595
VD1-VD11 = LED_single: ValueManufacturerPartNumber: LED, *, *, *, -55...+150°C; Manufacturer: *; Package: *; HelpURL: *; Temperature: -55...+150°C; TypeDiode: LED; Current: *; VoltageDrop: *; PartNumber: *
VT1-VT12 = IRLML9301: Mosfet; Model: *; Manufacturer: *; ComponentKind: *; HelpURL: *
X15 = Component-2pin

## Nets that join several sheets
+1V2: MB_FPGA (18 pins), MB_Power (12 pins)
+1V8DAC: MB_Power (C39.1 C40.2 U5.2 U5.4), MB_DAC (U14.21 U14.47 U14.48)
+2V5: MB_FPGA (5 pins), MB_Power (10 pins)
+3V3: MB_Conn (R1.2 R2.2 X2.4), MB_FPGA (20 pins), MB_Power (11 pins)
+3V3ADC: MB_Power (C42.1 L1.2), MB_ADC (14 pins)
+3V3ATT: MB_Power (C60.1 C61.1 FB6.1), MB_RF (C128.1 D1.5 D1.6 D1.9)
+3V3DAC: MB_Power (10 pins), MB_DAC (5 pins)
+3V3R: MB_Conn (C167.2 R85.1 X7.4), MB_Power (C85.1 C86.1 FB8.1), MB_Control (16 pins)
+3V3RF: MB_Power (C71.1 C72.1 FB7.1), MB_RF (6 pins)
+5: MB_Conn (C12.1 FB1.1 X1.23 X1.24), MB_FPGA (FB3.2), MB_Power (12 pins)
+9V: MB_Power (5 pins), MB_DAC (5 pins)
+12: MB_Conn (6 pins), MB_Power (FB5.2), MB_Control (24 pins)
GND: MB_Conn (26 pins), MB_FPGA (38 pins), MB_Power (61 pins), MB_ADC (29 pins), MB_DAC (42 pins), MB_RF (104 pins), MB_Control (21 pins)
ADC_IN: MB_ADC (T1.6 T1.10), MB_RF (K2.2 K2.5)
ATT_0.5: MB_RF (R46.2), MB_Control (U24.5)
ATT_1: MB_RF (R45.2), MB_Control (U24.6)
ATT_2: MB_RF (R42.2), MB_Control (U24.7)
ATT_4: MB_RF (R41.2), MB_Control (U22.15)
ATT_8: MB_RF (R38.2), MB_Control (U22.1)
ATT_16: MB_RF (R37.2), MB_Control (U24.4)
AUDIO_48K_CLOCK: MB_Conn (X1.20), MB_FPGA (U3.136)
AUDIO_I2S_CLOCK: MB_Conn (X1.19), MB_FPGA (U3.135)
BPF1_A0: MB_RF (R39.2), MB_Control (U22.7)
BPF1_A1: MB_RF (R43.2), MB_Control (U22.6)
BPF1_EN: MB_RF (R35.2), MB_Control (U22.5)
BPF2_A0: MB_RF (R40.1), MB_Control (U22.4)
BPF2_A1: MB_RF (R44.1), MB_Control (U22.3)
BPF2_EN: MB_RF (R36.1), MB_Control (U22.2)
CLK_122.88M: MB_FPGA (R12.1 R13.2 U3.89 XG1.4), MB_ADC (U11.12)
CLK_N_122.88M: MB_FPGA (R9.1 R10.2 U3.88 XG1.5), MB_ADC (U11.13)
CLKOUTA: MB_FPGA (U3.90), MB_ADC (U11.41)
CTRL CLK: MB_Conn (X1.4 X7.3), MB_Control (7 pins)
CTRL DATA: MB_Conn (X1.3), MB_Control (U19.2)
CTRL OE: MB_Conn (X1.6 X7.1), MB_Control (7 pins)
CTRL RCLK: MB_Conn (X1.1 X7.2), MB_Control (7 pins)
DA0: MB_FPGA (U3.68), MB_ADC (U11.42)
DA1: MB_FPGA (U3.67), MB_ADC (U11.43)
DA2: MB_FPGA (U3.66), MB_ADC (U11.44)
DA3: MB_FPGA (U3.65), MB_ADC (U11.45)
DA4: MB_FPGA (U3.64), MB_ADC (U11.46)
DA5: MB_FPGA (U3.60), MB_ADC (U11.47)
DA6: MB_FPGA (U3.59), MB_ADC (U11.48)
DA7: MB_FPGA (U3.58), MB_ADC (U11.51)
DA8: MB_FPGA (U3.55), MB_ADC (U11.52)
DA9: MB_FPGA (U3.54), MB_ADC (U11.53)
DA10: MB_FPGA (U3.53), MB_ADC (U11.54)
DA11: MB_FPGA (U3.52), MB_ADC (U11.55)
DA12: MB_FPGA (U3.51), MB_ADC (U11.56)
DA13: MB_FPGA (U3.50), MB_ADC (U11.57)
DA14: MB_FPGA (U3.49), MB_ADC (U11.58)
DA15: MB_FPGA (U3.46), MB_ADC (U11.59)
DAC1: MB_FPGA (U3.101), MB_DAC (U14.16)
DAC2: MB_FPGA (U3.103), MB_DAC (U14.15)
DAC3: MB_FPGA (U3.104), MB_DAC (U14.14)
DAC4: MB_FPGA (U3.105), MB_DAC (U14.13)
DAC5: MB_FPGA (U3.106), MB_DAC (U14.12)
DAC6: MB_FPGA (U3.110), MB_DAC (U14.11)
DAC7: MB_FPGA (U3.111), MB_DAC (U14.10)
DAC8: MB_FPGA (U3.112), MB_DAC (U14.9)
DAC9: MB_FPGA (U3.113), MB_DAC (U14.8)
DAC10: MB_FPGA (U3.114), MB_DAC (U14.7)
DAC11: MB_FPGA (U3.115), MB_DAC (U14.6)
DAC12: MB_FPGA (U3.119), MB_DAC (U14.5)
DAC13: MB_FPGA (U3.120), MB_DAC (U14.4)
DAC14: MB_FPGA (U3.121), MB_DAC (U14.3)
DAC_CLK: MB_FPGA (U3.125), MB_DAC (R34.2)
DAC_DIV0: MB_FPGA (U3.85), MB_DAC (U14.28)
DAC_DIV1: MB_FPGA (U3.86), MB_DAC (U14.27)
DAC_DRV_A0: MB_FPGA (U3.76), MB_DAC (R25.2)
DAC_DRV_A1: MB_FPGA (U3.77), MB_DAC (R28.2)
DAC_HP1: MB_FPGA (U3.99), MB_DAC (U14.17)
DAC_HP2: MB_FPGA (U3.98), MB_DAC (U14.18)
DAC_PD: MB_FPGA (U3.100), MB_DAC (U14.36)
DAC_X4: MB_FPGA (U3.87), MB_DAC (U14.23)
DCDC_SYNC: MB_Conn (X1.22), MB_FPGA (U3.133)
DITH: MB_FPGA (U3.71), MB_ADC (U11.20)
EXT_BAND0: MB_Conn (X5.10), MB_Control (R83.5)
EXT_BAND1: MB_Conn (X5.9), MB_Control (R83.6)
EXT_BAND2: MB_Conn (X5.8), MB_Control (R83.7)
EXT_BAND3: MB_Conn (X5.7), MB_Control (R83.8)
EXT_RZV1: MB_Conn (X5.3), MB_Control (R84.7)
EXT_TUNE: MB_Conn (X5.5), MB_Control (R84.6)
EXT_TX: MB_Conn (X5.6), MB_Control (R84.5)
FPGA_BUS_D0: MB_Conn (X1.9), MB_FPGA (U3.31)
FPGA_BUS_D1: MB_Conn (X1.12), MB_FPGA (U3.30)
FPGA_BUS_D2: MB_Conn (X1.11), MB_FPGA (U3.28)
FPGA_BUS_D3: MB_Conn (X1.14), MB_FPGA (U3.144)
FPGA_BUS_D4: MB_Conn (X1.13), MB_FPGA (U3.143)
FPGA_BUS_D5: MB_Conn (X1.16), MB_FPGA (U3.142)
FPGA_BUS_D6: MB_Conn (X1.15), MB_FPGA (U3.141)
FPGA_BUS_D7: MB_Conn (X1.18), MB_FPGA (U3.137)
FPGA_CLK: MB_Conn (X1.7), MB_FPGA (U3.33)
FPGA_SYNC: MB_Conn (X1.10), MB_FPGA (U3.32)
HFAMP_B0: MB_Conn (C1.1 X3.8), MB_Control (R53.1 U20.3)
HFAMP_B1: MB_Conn (C3.1 X3.7), MB_Control (R53.2 U20.4)
HFAMP_B2: MB_Conn (C4.1 X3.6), MB_Control (R53.3 U20.5)
HFAMP_B3: MB_Conn (C5.1 X3.5), MB_Control (R53.4 U20.6)
HFAMP_TX: MB_Conn (C6.1 X3.9), MB_Control (R62.2 VT6.3)
JTAG_1: MB_Conn (X2.1), MB_FPGA (U3.16)
JTAG_3: MB_Conn (X2.3), MB_FPGA (U3.20)
JTAG_5: MB_Conn (R2.1 X2.5), MB_FPGA (U3.18)
JTAG_9: MB_Conn (R1.1 X2.9), MB_FPGA (U3.15)
OFA: MB_FPGA (U3.44), MB_ADC (U11.60)
ON_VHF+: MB_DAC (C99.2 K1.1), MB_RF (C166.2 K2.1), MB_Control (R47.2 VT1.3)
PGA: MB_FPGA (U3.42), MB_ADC (U11.64)
PREAMP: MB_FPGA (U3.69), MB_ADC (R17.2)
RAND: MB_FPGA (U3.43), MB_ADC (U11.63)
SHDN: MB_FPGA (U3.72), MB_ADC (U11.19)
SOUT_EXT: MB_Conn (X4.10 X7.5), MB_Control (R67.1)
SOUT_Tuner: MB_Conn (X4.8), MB_Control (R67.2 U22.9)
TUNE CLK: MB_Conn (X4.9), MB_Control (R60.4)
TUNE OE: MB_Conn (X4.5), MB_Control (R60.2)
TUNE RCLK: MB_Conn (X4.7), MB_Control (R60.3)
TUNE_ANT: MB_Conn (X4.1), MB_Control (R69.2 VT8.3)
TUNE_T: MB_Conn (X4.2), MB_Control (R75.2 VT10.3)
VHF_1.2G: MB_Conn (C22.1 X6.5), MB_Control (R50.2 VT2.3)
VHF_2.4G: MB_Conn (C23.1 X6.3), MB_Control (R55.2 VT4.3)
VHF_144: MB_Conn (C20.1 X6.8), MB_Control (R74.2 VT9.3)
VHF_430: MB_Conn (C21.1 X6.6), MB_Control (R80.2 VT11.3)
VHF_FM: MB_Conn (C19.1 X6.10), MB_Control (R61.2 VT5.3)
VHF_LNA: MB_Conn (C18.1 X6.7), MB_Control (R68.2 VT7.3)
VHF_TX: MB_Conn (C17.1 X6.9), MB_Control (R54.2 VT3.3)